# Altium project ECTU.PrjPcb
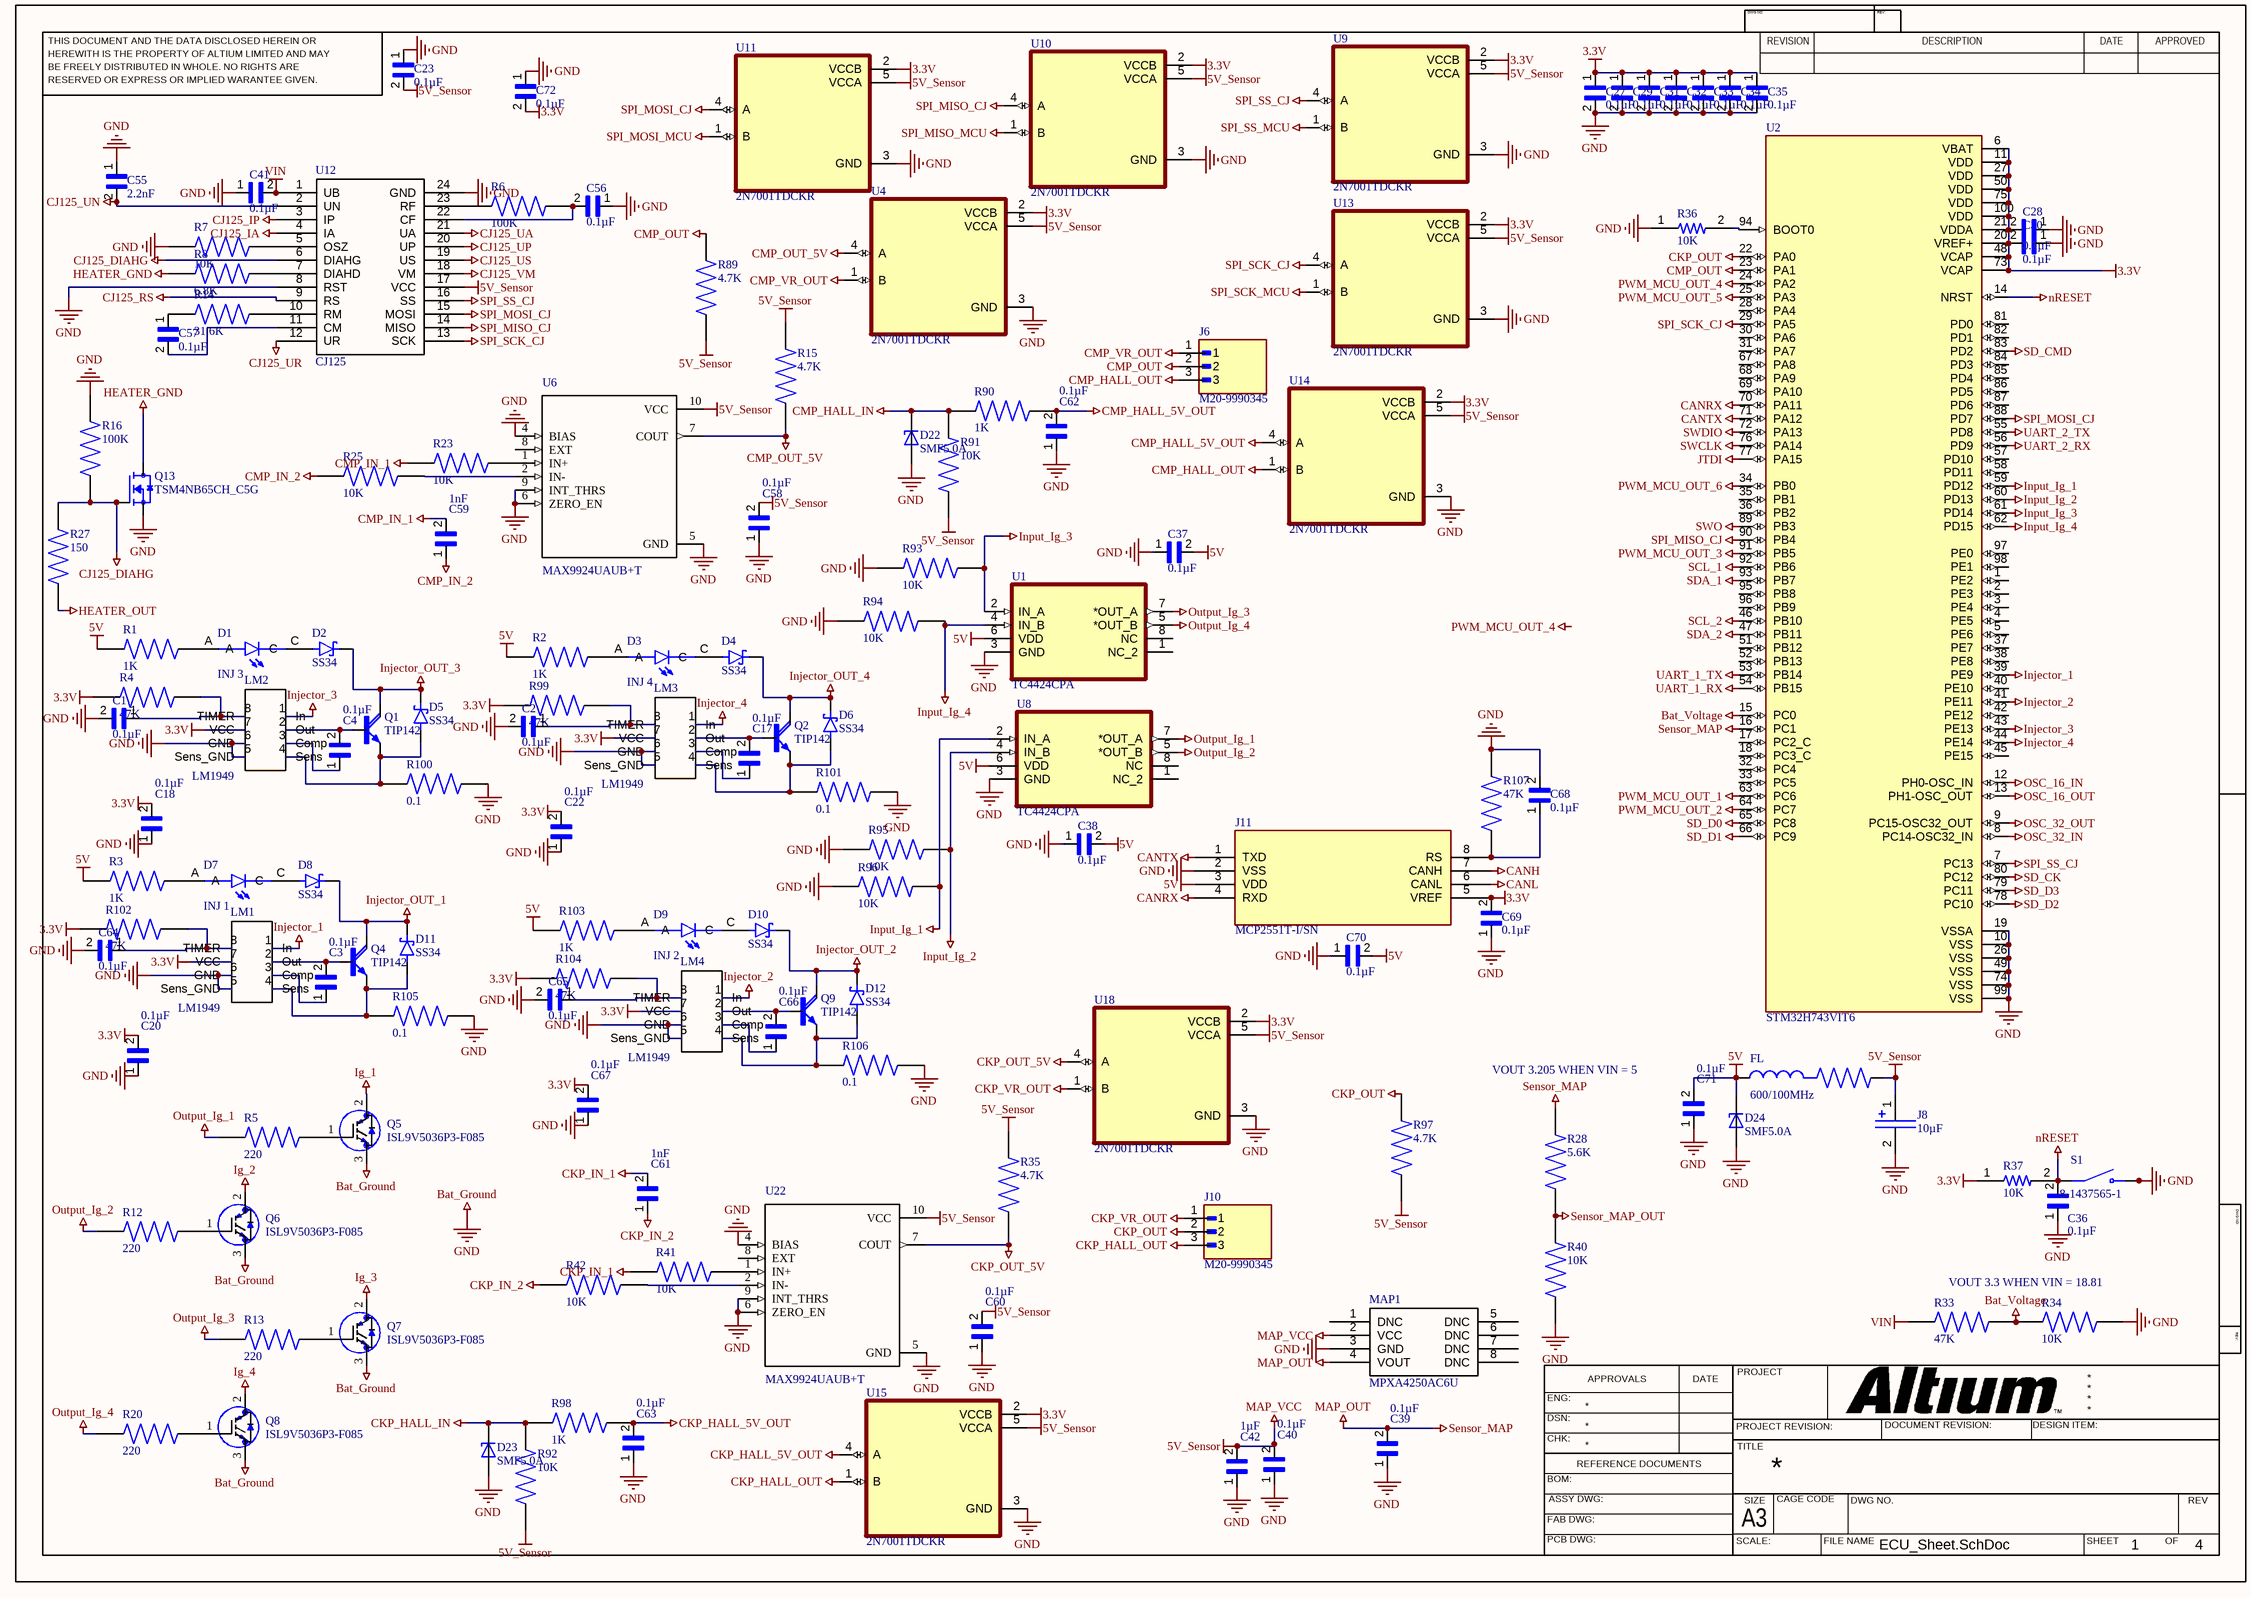
[diagram p0: ECU_Sheet.SchDoc]
4 sheets, 273 parts. Net scope: global (net labels, ports and power ports of the same name join across sheets).
Board file: ECTU_PCB.PcbDoc
Sheets:
  ECU_Sheet.SchDoc
  CCU_Sheet.SchDoc
  Analog_Sensors_Sheet.SchDoc
  Display_IOT_Sheet.SchDoc

## Sheet ECU_Sheet.SchDoc
size 420 x 297 mm; SheetNumber: 1; SheetTotal: 4

### Parts
C1  0.1µF  [CAPC1608X90N]
C2  0.1µF  [CAPC1608X90N]
C3  0.1µF  [CAPC1608X90N]
C4  0.1µF  [CAPC1608X90N]
C17  0.1µF  [CAPC1608X90N]
C18  0.1µF  [CAPC1608X90N]
C20  0.1µF  [CAPC1608X90N]
C22  0.1µF  [CAPC1608X90N]
C23  0.1µF  [CAPC1608X90N]
C27  0.1µF  [CAPC1608X90N]
C28  0.1µF  [CAPC1608X90N]
C29  0.1µF  [CAPC1608X90N]
C30  0.1µF  [CAPC1608X90N]
C31  0.1µF  [CAPC1608X90N]
C32  0.1µF  [CAPC1608X90N]
C33  0.1µF  [CAPC1608X90N]
C34  0.1µF  [CAPC1608X90N]
C35  0.1µF  [CAPC1608X90N]
C36  0.1µF  [CAPC1608X90N]
C37  0.1µF  [CAPC1608X90N]
C38  0.1µF  [CAPC1608X90N]
C39  0.1µF  [CAPC1608X90N]
C40  0.1µF  [CAPC1608X90N]
C41  0.1µF  [CAPC1608X90N]
C42  1µF  [CAPC1608X90N]
C55  2.2nF  [CAPC1608X90N]
C56  0.1µF  [CAPC1608X90N]
C57  0.1µF  [CAPC1608X90N]
C58  0.1µF  [CAPC1608X90N]
C59  1nF  [CAPC1608X90N]
C60  0.1µF  [CAPC1608X90N]
C61  1nF  [CAPC1608X90N]
C62  0.1µF  [CAPC1608X90N]
C63  0.1µF  [CAPC1608X90N]
C64  0.1µF  [CAPC1608X90N]
C65  0.1µF  [CAPC1608X90N]
C66  0.1µF  [CAPC1608X90N]
C67  0.1µF  [CAPC1608X90N]
C68  0.1µF  [CAPC1608X90N]
C69  0.1µF  [CAPC1608X90N]
C70  0.1µF  [CAPC1608X90N]
C71  0.1µF  [CAPC1608X90N]
C72  0.1µF  [CAPC1608X90N]
D1  INJ 3  [LEDC2012X70N]
D2  SS34  [DIO_SS34]
D3  INJ 4  [LEDC2012X70N]
D4  SS34  [DIO_SS34]
D5  SS34  [DIO_SS34]
D6  SS34  [DIO_SS34]
D7  INJ 1  [LEDC2012X70N]
D8  SS34  [DIO_SS34]
D9  INJ 2  [LEDC2012X70N]
D10  SS34  [DIO_SS34]
D11  SS34  [DIO_SS34]
D12  SS34  [DIO_SS34]
D22  SMF5.0A  [SODFL3718X102N]
D23  SMF5.0A  [SODFL3718X102N]
D24  SMF5.0A  [SODFL3718X102N]
FL  600/100MHz  [BEADC1608X95N]
J6  M20-9990345  [HARWIN_M20-9990345]
J8  10µF  [T491A106K010AT]
J10  M20-9990345  [HARWIN_M20-9990345]
J11  MCP2551T-I/SN  [SOIC8-N_MC]
LM1  LM1949  [DIP794W45P254L959H508Q8]
LM2  LM1949  [DIP794W45P254L959H508Q8]
LM3  LM1949  [DIP794W45P254L959H508Q8]
LM4  LM1949  [DIP794W45P254L959H508Q8]
MAP1  MPXA4250AC6U  [SOIC127P1041X990-8N]
Q1  TIP142  [SOT93]
Q2  TIP142  [SOT93]
Q4  TIP142  [SOT93]
Q5  ISL9V5036P3-F085  [*TO254P470X1016X2019-3P]
Q6  ISL9V5036P3-F085  [*TO254P470X1016X2019-3P]
Q7  ISL9V5036P3-F085  [*TO254P470X1016X2019-3P]
Q8  ISL9V5036P3-F085  [*TO254P470X1016X2019-3P]
Q9  TIP142  [SOT93]
Q13  TSM4NB65CH_C5G  [TO228P680X240X837-3]
R1  1K  [RESC3116X65N]
R2  1K  [RESC3116X65N]
R3  1K  [RESC3116X65N]
R4  47K  [RESC3116X65N]
R5  220  [RES_ERJP08J221V]
R6  100K  [RESC3116X65N]
R7  10K  [RESC3116X65N]
R8  6.8K  [RESC3116X65N]
R12  220  [RES_ERJP08J221V]
R13  220  [RES_ERJP08J221V]
R14  31.6K  [RESC3116X65N]
R15  4.7K  [RESC3116X65N]
R16  100K  [RESC3116X65N]
R20  220  [RES_ERJP08J221V]
R23  10K  [RESC3116X65N]
R25  10K  [RESC3116X65N]
R27  150  [RESC3116X65N]
R28  5.6K  [RESC3116X65N]
R33  47K  [RESC3116X65N]
R34  10K  [RESC3116X65N]
R35  4.7K  [RESC3116X65N]
R36  10K  [RESC1608X50N]
R37  10K  [RESC1608X50N]
R40  10K  [RESC3116X65N]
R41  10K  [RESC3116X65N]
R42  10K  [RESC3116X65N]
R89  4.7K  [RESC3116X65N]
R90  1K  [RESC3116X65N]
R91  10K  [RESC3116X65N]
R92  10K  [RESC3116X65N]
R93  10K  [RESC3116X65N]
R94  10K  [RESC3116X65N]
R95  10K  [RESC3116X65N]
R96  10K  [RESC3116X65N]
R97  4.7K  [RESC3116X65N]
R98  1K  [RESC3116X65N]
R99  47K  [RESC3116X65N]
R100  0.1  [RES_ERJ6RSFR10V]
R101  0.1  [RES_ERJ6RSFR10V]
R102  47K  [RESC3116X65N]
R103  1K  [RESC3116X65N]
R104  47K  [RESC3116X65N]
R105  0.1  [RES_ERJ6RSFR10V]
R106  0.1  [RES_ERJ6RSFR10V]
R107  47K  [RESC3116X65N]
S1  8-1437565-1  [SW_8-1437565-1]
U1  TC4424CPA  [DIP254P762X432-8]
U2  STM32H743VIT6  [QFP50P1600X1600X160-100N]
U4  2N7001TDCKR  [SOT65P210X110-5N]
U6  MAX9924UAUB+T  [*SOP50P490X110-10N]
U8  TC4424CPA  [DIP254P762X432-8]
U9  2N7001TDCKR  [SOT65P210X110-5N]
U10  2N7001TDCKR  [SOT65P210X110-5N]
U11  2N7001TDCKR  [SOT65P210X110-5N]
U12  CJ125  [CJ125]
U13  2N7001TDCKR  [SOT65P210X110-5N]
U14  2N7001TDCKR  [SOT65P210X110-5N]
U15  2N7001TDCKR  [SOT65P210X110-5N]
U18  2N7001TDCKR  [SOT65P210X110-5N]
U22  MAX9924UAUB+T  [*SOP50P490X110-10N]

### Nets
3.3V: C18.2 C20.2 C22.2 C27.1 C28.2 C29.1 C30.2 C31.1 C32.1 C33.1 C34.1 C35.1 C67.2 C69.2 C72.2 J11.5(VREF) LM1.7(VCC) LM2.7(VCC) LM3.7(VCC) LM4.7(VCC) R4.1 R37.1 R99.1 R102.1 R104.1 U2.6(VBAT) U2.11(VDD) U2.20(VREF+) U2.21(VDDA) U2.27(VDD) U2.48(VCAP) U2.50(VDD) U2.73(VCAP) U2.75(VDD) U2.100(VDD) U4.2(VCCB) U9.2(VCCB) U10.2(VCCB) U11.2(VCCB) U13.2(VCCB) U14.2(VCCB) U15.2(VCCB) U18.2(VCCB)
5V: C37.2 C38.2 C70.2 C71.2 D24.C FL.1 J11.3(VDD) R1.1 R2.1 R3.1 R103.1 U1.6(VDD) U8.6(VDD)
5V_Sensor: C23.2 C40.2 C42.2 C58.2 C60.2 FL.2 J8.1(P$1) MAP1.2(VCC) R15.2 R35.2 R89.1 R91.1 R92.1 R97.1 U4.5(VCCA) U6.10(VCC) U9.5(VCCA) U10.5(VCCA) U11.5(VCCA) U12.17(VCC) U13.5(VCCA) U14.5(VCCA) U15.5(VCCA) U18.5(VCCA) U22.10(VCC)  [also labelled MAP_VCC]
Bat_Ground: C1.2 C2.2 C18.1 C20.1 C22.1 C23.1 C27.2 C28.1 C29.2 C30.1 C31.2 C32.2 C33.2 C34.2 C35.2 C36.1 C37.1 C38.1 C39.1 C40.1 C41.1 C42.1 C55.1 C56.1 C58.1 C60.1 C62.1 C63.1 C64.2 C65.2 C67.1 C68.2 C69.1 C70.1 C71.1 C72.1 D22.A D23.A D24.A J8.2(P$2) J11.2(VSS) LM1.5(Sens_GND) LM1.6(GND) LM2.5(Sens_GND) LM2.6(GND) LM3.5(Sens_GND) LM3.6(GND) LM4.5(Sens_GND) LM4.6(GND) MAP1.3(GND) Q5.3(E) Q6.3(E) Q7.3(E) Q8.3(E) Q13.3(S) R7.1 R16.2 R34.2 R36.1 R40.1 R93.1 R94.1 R95.1 R96.1 R100.2 R101.2 R105.2 R106.2 R107.2 S1.3(NO) S1.4(NO) U1.3(GND) U2.10(VSS) U2.19(VSSA) U2.26(VSS) U2.49(VSS) U2.74(VSS) U2.99(VSS) U4.3(GND) U6.4(BIAS) U6.5(GND) U6.6(ZERO_EN) U6.9(INT_THRS) U8.3(GND) U9.3(GND) U10.3(GND) U11.3(GND) U12.8(RST) U12.24(GND) U13.3(GND) U14.3(GND) U15.3(GND) U18.3(GND) U22.4(BIAS) U22.5(GND) U22.6(ZERO_EN) U22.9(INT_THRS)  [also labelled GND]
Bat_Voltage: R33.2 R34.1 U2.15(PC0)
CANH: J11.7(CANH)
CANL: J11.6(CANL)
CANRX: J11.4(RXD) U2.70(PA11)
CANTX: J11.1(TXD) U2.71(PA12)
CJ125_DIAHG: Q13.1(G) R16.1 R27.2 U12.6(DIAHG)
CJ125_IA: U12.4(IA)
CJ125_IP: U12.3(IP)
CJ125_RS: U12.9(RS)
CJ125_UA: U12.21(UA)
CJ125_UN: C55.2 U12.2(UN)
CJ125_UP: U12.20(UP)
CJ125_UR: U12.12(UR)
CJ125_US: U12.19(US)
CJ125_VM: U12.18(VM)
CKP_HALL_5V_OUT: C63.2 R98.1 U15.4(A)
CKP_HALL_IN: D23.C R92.2 R98.2
CKP_HALL_OUT: J10.3 U15.1(B)
CKP_IN_1: C61.2 R41.1
CKP_IN_2: C61.1 R42.1
CKP_OUT: J10.2 R97.2 U2.22(PA0)
CKP_OUT_5V: R35.1 U18.4(A) U22.7(COUT)
CKP_VR_OUT: J10.1 U18.1(B)
CMP_HALL_5V_OUT: C62.2 R90.1 U14.4(A)
CMP_HALL_IN: D22.C R90.2 R91.2
CMP_HALL_OUT: J6.3 U14.1(B)
CMP_IN_1: C59.2 R23.1
CMP_IN_2: C59.1 R25.1
CMP_OUT: J6.2 R89.2 U2.23(PA1)
CMP_OUT_5V: R15.1 U4.4(A) U6.7(COUT)
CMP_VR_OUT: J6.1 U4.1(B)
HEATER_GND: Q13.2(D) R8.1
HEATER_OUT: R27.1
Ig_1: Q5.2(C)
Ig_2: Q6.2(C)
Ig_3: Q7.2(C)
Ig_4: Q8.2(C)
Injector_1: LM1.1(In) U2.39(PE9)
Injector_2: LM4.1(In) U2.41(PE11)
Injector_3: LM2.1(In) U2.43(PE13)
Injector_4: LM3.1(In) U2.44(PE14)
Injector_OUT_1: D8.C(K) D11.C(K) Q4.C
Injector_OUT_2: D10.C(K) D12.C(K) Q9.C
Injector_OUT_3: D2.C(K) D5.C(K) Q1.C
Injector_OUT_4: D4.C(K) D6.C(K) Q2.C
Input_Ig_1: R96.2 U2.59(PD12) U8.2(IN_A)
Input_Ig_2: R95.2 U2.60(PD13) U8.4(IN_B)
Input_Ig_3: R93.2 U1.2(IN_A) U2.61(PD14)
Input_Ig_4: R94.2 U1.4(IN_B) U2.62(PD15)
JTDI: U2.77(PA15)
MAP_OUT: C39.2 MAP1.4(VOUT) R28.1 U2.16(PC1)  [also labelled Sensor_MAP]
nRESET: C36.2 R37.2 S1.1(COM) S1.2(COM) U2.14(NRST)
OSC_16_IN: U2.12(PH0-OSC_IN)
OSC_16_OUT: U2.13(PH1-OSC_OUT)
OSC_32_IN: U2.8(PC14-OSC32_IN)
OSC_32_OUT: U2.9(PC15-OSC32_OUT)
Output_Ig_1: R5.1 U8.7(*OUT_A)
Output_Ig_2: R12.1 U8.5(*OUT_B)
Output_Ig_3: R13.1 U1.7(*OUT_A)
Output_Ig_4: R20.1 U1.5(*OUT_B)
PWM_MCU_OUT_1: U2.63(PC6)
PWM_MCU_OUT_2: U2.64(PC7)
PWM_MCU_OUT_3: U2.91(PB5)
PWM_MCU_OUT_4: U2.24(PA2)
PWM_MCU_OUT_5: U2.25(PA3)
PWM_MCU_OUT_6: U2.34(PB0)
SCL_1: U2.92(PB6)
SCL_2: U2.46(PB10)
SD_CK: U2.80(PC12)
SD_CMD: U2.83(PD2)
SD_D0: U2.65(PC8)  [project net DATA_0]
SD_D1: U2.66(PC9)  [project net DATA_1]
SD_D2: U2.78(PC10)  [project net DATA_2]
SD_D3: U2.79(PC11)  [project net DATA_3]
SDA_1: U2.93(PB7)
SDA_2: U2.47(PB11)
Sensor_MAP_OUT: R28.2 R40.2
SPI_MISO_CJ: U2.90(PB4) U10.4(A) U12.14(MISO)
SPI_MISO_MCU: U10.1(B)
SPI_MOSI_CJ: U2.88(PD7) U11.4(A) U12.15(MOSI)
SPI_MOSI_MCU: U11.1(B)
SPI_SCK_CJ: U2.29(PA5) U12.13(SCK) U13.4(A)
SPI_SCK_MCU: U13.1(B)
SPI_SS_CJ: U2.7(PC13) U9.4(A) U12.16(SS)
SPI_SS_MCU: U9.1(B)
SWCLK: U2.76(PA14)
SWDIO: U2.72(PA13)
SWO: U2.89(PB3)
UART_1_RX: U2.54(PB15)
UART_1_TX: U2.53(PB14)
UART_2_RX: U2.56(PD9)
UART_2_TX: U2.55(PD8)
VIN: C41.2 R33.1 U12.1(UB)
NetC1_1: C1.1 LM2.8(TIMER) R4.2
NetC2_1: C2.1 LM3.8(TIMER) R99.2
NetC3_1: C3.1 LM1.3(Comp)
NetC3_2: C3.2 LM1.2(Out) Q4.B
NetC4_1: C4.1 LM2.3(Comp)
NetC4_2: C4.2 LM2.2(Out) Q1.B
NetC17_1: C17.1 LM3.3(Comp)
NetC17_2: C17.2 LM3.2(Out) Q2.B
NetC56_2: C56.2 R6.2 U12.22(CF)
NetC57_1: C57.1 R14.1
NetC57_2: C57.2 U12.11(CM)
NetC64_1: C64.1 LM1.8(TIMER) R102.2
NetC65_1: C65.1 LM4.8(TIMER) R104.2
NetC66_1: C66.1 LM4.3(Comp)
NetC66_2: C66.2 LM4.2(Out) Q9.B
NetC68_1: C68.1 J11.8(RS) R107.1
NetD1_A: D1.A R1.2
NetD1_C: D1.C D2.A
NetD3_A: D3.A R2.2
NetD3_C: D3.C D4.A
NetD5_A: D5.A LM2.4(Sens) Q1.E R100.1
NetD6_A: D6.A LM3.4(Sens) Q2.E R101.1
NetD7_A: D7.A R3.2
NetD7_C: D7.C D8.A
NetD9_A: D9.A R103.2
NetD9_C: D9.C D10.A
NetD11_A: D11.A LM1.4(Sens) Q4.E R105.1
NetD12_A: D12.A LM4.4(Sens) Q9.E R106.1
NetQ5_1: Q5.1(G) R5.2
NetQ6_1: Q6.1(G) R12.2
NetQ7_1: Q7.1(G) R13.2
NetQ8_1: Q8.1(G) R20.2
NetR6_1: R6.1 U12.23(RF)
NetR7_2: R7.2 U12.5(OSZ)
NetR8_2: R8.2 U12.7(DIAHD)
NetR14_2: R14.2 U12.10(RM)
NetR23_2: R23.2 U6.1(IN+)
NetR25_2: R25.2 U6.2(IN-)
NetR36_2: R36.2 U2.94(BOOT0)
NetR41_2: R41.2 U22.1(IN+)
NetR42_2: R42.2 U22.2(IN-)

Not connected (* = marked no-connect by the designer): MAP1 1(DNC) 5(DNC) 6(DNC) 7(DNC) 8(DNC); U1 1(NC_2) 8(NC); U2 1(PE2) 2(PE3) 3(PE4) 4(PE5) 5(PE6) 17(PC2_C) 18(PC3_C) 28(PA4) 30(PA6) 31(PA7) 32(PC4) 33(PC5) 35(PB1) 36(PB2) 37(PE7) 38(PE8) 40(PE10) 42(PE12) 45(PE15) 51(PB12) 52(PB13) 57(PD10) 58(PD11) 67(PA8) 68(PA9) 69(PA10) 81(PD0) 82(PD1) 84(PD3) 85(PD4) 86(PD5) 87(PD6) 95(PB8) 96(PB9) 97(PE0) 98(PE1); U6 8(EXT); U8 1(NC_2) 8(NC); U22 8(EXT)

### Notes on the sheet
- VOUT 3.205 WHEN VIN = 5
- VOUT 3.3 WHEN VIN = 18.81
- Labels drawn without touching a wire or pin: PWM_MCU_OUT_4
- THIS DOCUMENT AND THE DATA DISCLOSED HEREIN OR
- HEREWITH IS THE PROPERTY OF ALTIUM LIMITED AND MAY
- DWG NO:
- REVISION
- REV:
- DESCRIPTION
- DATE
- APPROVED
- BE FREELY DISTRIBUTED IN WHOLE. NO RIGHTS ARE
- RESERVED OR EXPRESS OR IMPLIED WARANTEE GIVEN.
- ENG:
- APPROVALS
- PROJECT
- DSN:
- CHK:
- REFERENCE DOCUMENTS
- PROJECT REVISION:
- TITLE
- DOCUMENT REVISION:
- DESIGN ITEM:
- BOM:
- FAB DWG:
- PCB DWG:
- ASSY DWG:
- SCALE:
- A3
- SIZE
- CAGE CODE
- FILE NAME
- DWG NO.
- SHEET
- OF
- REV

### Library data of the parts
C1-C4 C17 C18 C20 C22 C23 C27-C42 C55-C72 = 06035C104MAZ2A: Multilayer Ceramic Capacitors MLCC - SMD/SMT; Package: None; Price: None; Value: *; MP: 06035C104MAZ2A; Availability: Unavailable
D1 D3 D7 D9 = 597-3305-607F: LED Uni-Color Green 4-Pin Chip 0805 T/R; Availability: Unavailable; Value: *; Price: None; MP: 597-3305-607F; Package: None
D2 D4-D6 D8 D10-D12 = SS34: 3A, 40V, Schottky Rectifier; MF: Taiwan Semiconductor; SnapEDA_Link: https://www.snapeda.com/parts/SS34/Taiwan+Semiconductor/view-part/?ref=snap; Package: DO-214AB-2 Taiwan Semiconductor; Value: *; MP: SS34; Check_prices: https://www.snapeda.com/parts/SS34/Taiwan+Semiconductor/view-part/?ref=eda
D22-D24 = SMF5.0A: 200W, 6.7V, 5%, Unidirectional, TVS; MF: Taiwan Semiconductor; SnapEDA_Link: https://www.snapeda.com/parts/SMF5.0A/taiwan/view-part/?ref=snap; Package: SOD-123W-2 Taiwan Semiconductor; Value: *; MP: SMF5.0A; Check_prices: https://www.snapeda.com/parts/SMF5.0A/taiwan/view-part/?ref=eda
FL = BLM18DN601SZ1D: 600 Ohms @ 100MHz 1 Ferrite Bead 0603 _1608 Metric_ 700mA; MF: Murata; Package: 1608 Murata; Availability: Unavailable; Value: *; MP: BLM18DN601SZ1D; SnapEDA_Link: https://www.snapeda.com/parts/BLM18DN601SZ1D/Murata/view-part/4302620/?ref=snap; Price: None
J6 J10 = M20-9990345: 2.54mm (0.1) Pitch SIL Vertical Throughboard Pin Header, 6.1mm mating pin height, gold (hi-temp mould), 3 contacts; MF: Harwin; SnapEDA_Link: https://www.snapeda.com/parts/M20-9990345/Harwin+Inc./view-part/?ref=snap; Package: None; Value: *; MP: M20-9990345; Check_prices: https://www.snapeda.com/parts/M20-9990345/Harwin+Inc./view-part/?ref=eda
J8 = T491A106K010AT: Condensador electrolÃ­tico de tantalio sÃ³lido MnO2 de 10 ÂµF, 10 V CC +/-10 %, serie T491 ¦ KEMET T491A106K010AT; SnapEDA_Link: https://www.snapeda.com/parts/T491A106K010AT/KEMET/view-part/?ref=snap; Package: SMD-2 KEMET; Value: *; MF: KEMET; MP: T491A106K010AT; Check_prices: https://www.snapeda.com/parts/T491A106K010AT/KEMET/view-part/?ref=eda
J11 = MCP2551T-I/SN: Microchip MCP2551T-I/SN, CAN Transceiver 1Mbit/s 1-channel ISO 11898, 8-Pin SOIC | Microchip Technology Inc. MCP2551T-I/SN; SnapEDA_Link: https://www.snapeda.com/parts/MCP2551T-I/SN/Microchip/view-part/?ref=snap; Package: SO-8 Microchip; Value: *; MF: Microchip; MP: MCP2551T-I/SN; Check_prices: https://www.snapeda.com/parts/MCP2551T-I/SN/Microchip/view-part/?ref=eda
LM1-LM4 = Component_1
Q1 Q2 Q4 Q9 = TIP142: Bipolar (BJT) Transistor NPN - Darlington 100 V 10 A - 125 W Through Hole TO-247-3; MF: ON Semiconductor; SnapEDA_Link: https://www.snapeda.com/parts/TIP142/Onsemi/view-part/?ref=snap; Package: SOT-93-3 ON Semiconductor; Value: *; MP: TIP142; Check_prices: https://www.snapeda.com/parts/TIP142/Onsemi/view-part/?ref=eda
Q13 = TSM4NB65CH_C5G: 650V, 4A, Single N-Channel Power MOSFET; MF: Taiwan Semiconductor; MP: TSM4NB65CH C5G; SnapEDA_Link: https://www.snapeda.com/parts/TSM4NB65CH%20C5G/Taiwan+Semiconductor/view-part/?ref=snap; Package: TO-251 Taiwan Semiconductor; Value: *; Check_prices: https://www.snapeda.com/parts/TSM4NB65CH%20C5G/Taiwan+Semiconductor/view-part/?ref=eda
R1-R3 R103 = RC1206JR-071KL: RES, THICK FILM, 1K, 5%, 0.25W, 1206; Resistance:1kohm; Resistance Tolerance:Â± 5%; Power Rating:250mW; Resistor Case Style:1206 ^3216 Metric]; Resistor Technology:Thick Film; Resistor Type:General Purpose; Product Range:RC Series; MF: Yageo Corporation; MP: RC1206JR071KL; SnapEDA_Link: https://www.snapeda.com/parts/RC1206JR071KL/Yageo/view-part/?ref=snap; Package: 1206-2 YAGEO; Value: *; Check_prices: https://www.snapeda.com/parts/RC1206JR071KL/Yageo/view-part/?ref=eda
R4 R6-R8 R14-R16 R23 R25 R27 R28 R33-R35 R40-R42 R89-R99 R102 R104 R107 = AA1206JR-07470RL: Package: None; Price: None; Value: *; MP: AA1206JR-07470RL; Availability: Unavailable
R5 R12 R13 R20 = ERJP08J221V: Value: *; Price: None; Availability: Unavailable; Package: None; MP: ERJP08J221V
R36 R37 = RP73PF1J10KBTDF: Thin Film Resistors - SMD 10K OHM .1% 25PPM; Voltage_Rating: 75 V; Power_Rating: .166 W; MF: TE Connectivity; Mouser-Purchase-URL: https://snapeda.com/shop?store=Mouser&id=550687; Value: *; SnapEDA_Link: https://www.snapeda.com/parts/RP73PF1J10KBTDF/TE%20Connectivity%20Passive%20Product/view-part/550687/?ref=snap; MP: RP73PF1J10KBTDF; Tolerance: .1%; Digi-Key_Part_Number: A110204CT-ND; Resistance: 10K; Package: 0603
R100 R101 R105 R106 = ERJ6RSFR10V: Availability: Unavailable; MP: ERJ6RSFR10V; Price: None; Package: None; Value: *
U1 U8 = TC4424CPA: Dual MOSFET Power Driver 3A 4.5 to 18V Non-Inverting 8-Pin PDIP | Microchip Technology Inc. TC4424CPA; SnapEDA_Link: https://www.snapeda.com/parts/TC4424CPA/Microchip/view-part/?ref=snap; Package: DIP-8 Microchip; Value: *; MF: Microchip; MP: TC4424CPA; Check_prices: https://www.snapeda.com/parts/TC4424CPA/Microchip/view-part/?ref=eda
U2 = STM32H743VIT6: ARMÂ® CortexÂ®-M7 STM32H7 Microcontroller IC 32-Bit Single-Core 480MHz 2MB (2M x 8) FLASH 100-LQFP (14x14); MF: STMicroelectronics; SnapEDA_Link: https://www.snapeda.com/parts/STM32H743VIT6/STMicroelectronics/view-part/?ref=snap; Package: LQFP-100 STMicroelectronics; Value: *; MP: STM32H743VIT6; Check_prices: https://www.snapeda.com/parts/STM32H743VIT6/STMicroelectronics/view-part/?ref=eda
U4 U9-U11 U13-U15 U18 = 2N7001TDCKR: 1-bit dual-supply buffered voltage signal converter; MF: Texas Instruments; SnapEDA_Link: https://www.snapeda.com/parts/2N7001TDCKR/Texas+Instruments/view-part/?ref=snap; Package: SC70-5 Texas Instruments; Value: *; MP: 2N7001TDCKR; Check_prices: https://www.snapeda.com/parts/2N7001TDCKR/Texas+Instruments/view-part/?ref=eda
Q5-Q8 = ISL9V5036P3-F085: SnapEDA_Link: https://www.snapeda.com/parts/ISL9V5036P3-F085/Onsemi/view-part/?ref=snap; Check_prices: https://www.snapeda.com/parts/ISL9V5036P3-F085/Onsemi/view-part/?ref=eda; Value: *
S1 = 8-1437565-1: Package: None; MP: 8-1437565-1; Price: None; Availability: Unavailable; Value: *
U6 U22 = MAX9924UAUB+T: SnapEDA_Link: https://www.snapeda.com/parts/MAX9924UAUB+T/Maxim+Integrated/view-part/?ref=snap; Check_prices: https://www.snapeda.com/parts/MAX9924UAUB+T/Maxim+Integrated/view-part/?ref=eda; Value: *

## Sheet CCU_Sheet.SchDoc
size 420 x 297 mm; SheetNumber: 2; SheetTotal: 4
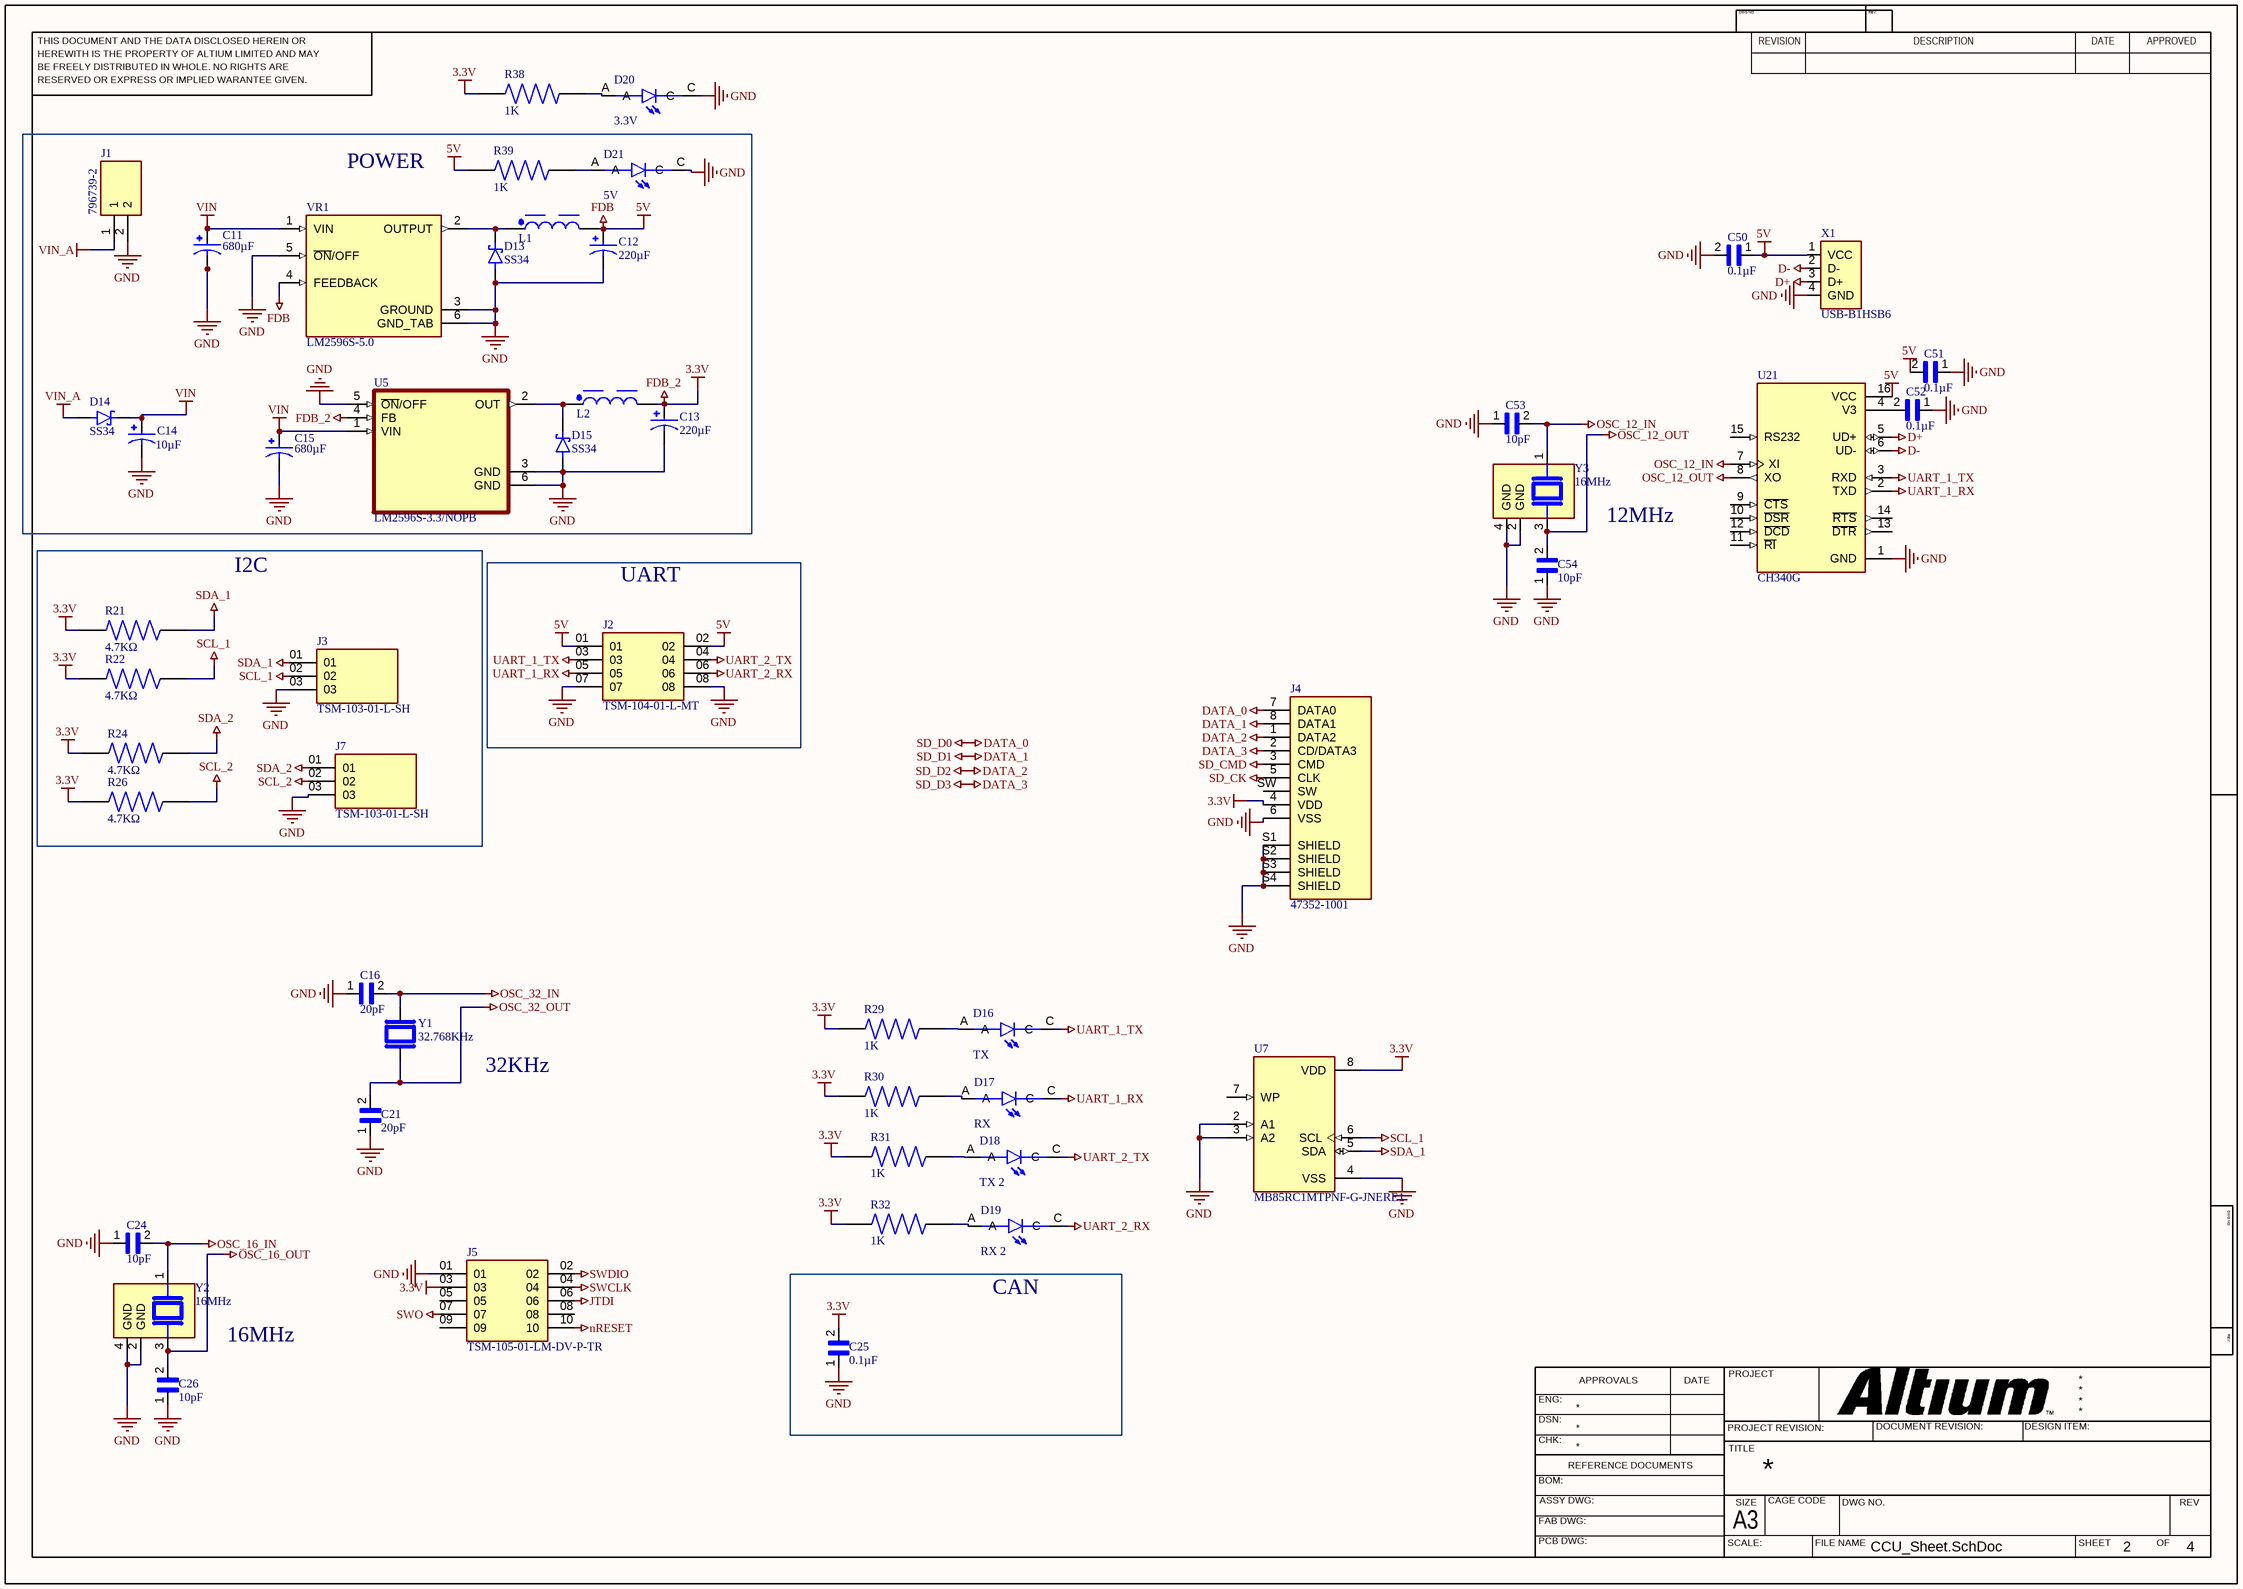
[diagram p1: CCU_Sheet.SchDoc]

### Parts
C11  680µF  [CAP_EEEFN1E681UV]
C12  220µF  [CAP_EEEFP1V221AV]
C13  220µF  [CAP_EEEFP1V221AV]
C14  10µF  [CAPPRD500W50D500H1100]
C15  680µF  [CAP_EEEFN1E681UV]
C16  20pF  [CAPC1005X61N]
C21  20pF  [CAPC1005X61N]
C24  10pF  [CAPC1005X61N]
C25  0.1µF  [CAPC1608X90N]
C26  10pF  [CAPC1005X61N]
C50  0.1µF  [CAPC1608X90N]
C51  0.1µF  [CAPC1608X90N]
C52  0.1µF  [CAPC1608X90N]
C53  10pF  [CAPC1005X61N]
C54  10pF  [CAPC1005X61N]
D13  SS34  [DIO_SS34]
D14  SS34  [DIO_SS34]
D15  SS34  [DIO_SS34]
D16  TX  [LEDC2012X70N]
D17  RX  [LEDC2012X70N]
D18  TX 2  [LEDC2012X70N]
D19  RX 2  [LEDC2012X70N]
D20  3.3V  [LEDC2012X70N]
D21  5V  [LEDC2012X70N]
J1  796739-2  [TE_796739-2]
J2  TSM-104-01-L-MT  [SAMTEC_TSM-104-01-L-MT]
J3  TSM-103-01-L-SH  [SAMTEC_TSM-103-01-L-SH]
J4  47352-1001  [MOLEX_47352-1001]
J5  TSM-105-01-LM-DV-P-TR  [SAMTEC_TSM-105-01-LM-DV-P-TR]
J7  TSM-103-01-L-SH  [SAMTEC_TSM-103-01-L-SH]
L1  33uH, 4.2A  [WE-PD_1210]  (value not drawn)
L2  33uH, 4.2A  [WE-PD_1210]  (value not drawn)
R21  4.7KΩ  [RES_ERJS06J472V]
R22  4.7KΩ  [RES_ERJS06J472V]
R24  4.7KΩ  [RES_ERJS06J472V]
R26  4.7KΩ  [RES_ERJS06J472V]
R29  1K  [RESC3116X65N]
R30  1K  [RESC3116X65N]
R31  1K  [RESC3116X65N]
R32  1K  [RESC3116X65N]
R38  1K  [RESC3116X65N]
R39  1K  [RESC3116X65N]
U5  LM2596S-3.3/NOPB  [VREG_LM2596S-3.3/NOPB]
U7  MB85RC1MTPNF-G-JNERE1  [SOIC127P600X175-8N]
U21  CH340G  [SOIC127P600X180-16N]
VR1  LM2596S-5.0  [TO170P1524X483-6N]
X1  USB-B1HSB6  [OST_USB-B1HSB6]
Y1  32.768KHz  [XTAL_ABS06-32.768KHZ-9-1-T]
Y2  16MHz  [XTAL_7M25090002]
Y3  16MHz  [XTAL_7M25090002]

### Blocks framed on the sheet
POWER: C11-C15 D13-D15 D21 J1 L1 L2 R39 U5 VR1
I2C: J3 J7 R21 R22 R24 R26
UART: J2
CAN: C25

### Nets
3.3V: C13.1 C25.2 J4.4(VDD) J5.03 L2.2 R21.2 R22.1 R24.2 R26.1 R29.1 R30.1 R31.1 R32.1 R38.1 U5.4(FB) U7.8(VDD)  [also labelled FDB_2]
5V: C12.1 C50.1 C51.2 J2.01 J2.02 L1.2 R39.1 U21.16(VCC) VR1.4(FEEDBACK) X1.1(VCC)  [also labelled FDB]
D+: U21.5(UD+) X1.3(D+)
D-: U21.6(UD-) X1.2(D-)
DATA_0: J4.7(DATA0)  [also labelled SD_D0]
DATA_1: J4.8(DATA1)  [also labelled SD_D1]
DATA_2: J4.1(DATA2)  [also labelled SD_D2]
DATA_3: J4.2(CD/DATA3)  [also labelled SD_D3]
GND: C11.2 C12.2 C13.2 C14.N C15.2 C16.1 C21.1 C24.1 C25.1 C26.1 C50.2 C51.1 C52.1 C53.1 C54.1 D13.A D15.A D20.C D21.C J1.2 J2.07 J2.08 J3.03 J4.6(VSS) J4.S1(SHIELD) J4.S2(SHIELD) J4.S3(SHIELD) J4.S4(SHIELD) J5.01 J7.03 U5.3(GND) U5.5(~{ON}/OFF) U5.6(GND) U7.2(A1) U7.3(A2) U7.4(VSS) U21.1(GND) VR1.3(GROUND) VR1.5(~{ON}/OFF) VR1.6(GND_TAB) X1.4(GND) Y2.2(GND) Y2.4(GND) Y3.2(GND) Y3.4(GND)  [project net Bat_Ground]
JTDI: J5.06
nRESET: J5.10
OSC_12_IN: C53.2 U21.7(XI) Y3.1
OSC_12_OUT: C54.2 U21.8(XO) Y3.3
OSC_16_IN: C24.2 Y2.1
OSC_16_OUT: C26.2 Y2.3
OSC_32_IN: C16.2 Y1.2
OSC_32_OUT: C21.2 Y1.1
SCL_1: J3.02 R22.2 U7.6(SCL)
SCL_2: J7.02 R26.2
SD_CK: J4.5(CLK)
SD_CMD: J4.3(CMD)
SDA_1: J3.01 R21.1 U7.5(SDA)
SDA_2: J7.01 R24.1
SWCLK: J5.04
SWDIO: J5.02
SWO: J5.07
UART_1_RX: D17.C J2.05 U21.2(TXD)
UART_1_TX: D16.C J2.03 U21.3(RXD)
UART_2_RX: D19.C J2.06
UART_2_TX: D18.C J2.04
VIN: C11.1 C14.P C15.1 D14.C(K) U5.1(VIN) VR1.1(VIN)
VIN_A: D14.A J1.1
NetC52_2: C52.2 U21.4(V3)
NetD13_C: D13.C(K) L1.1 VR1.2(OUTPUT)
NetD15_C: D15.C(K) L2.1 U5.2(OUT)
NetD16_A: D16.A R29.2
NetD17_A: D17.A R30.2
NetD18_A: D18.A R31.2
NetD19_A: D19.A R32.2
NetD20_A: D20.A R38.2
NetD21_A: D21.A R39.2

Not connected (* = marked no-connect by the designer): J4 SW; J5 05 08 09; U7 7(WP); U21 9(~{CTS}) 10(~{DSR}) 11(~{RI}) 12(~{DCD}) 13(~{DTR}) 14(~{RTS}) 15(RS232)

### Notes on the sheet
- 12MHz
- 32KHz
- 16MHz
- THIS DOCUMENT AND THE DATA DISCLOSED HEREIN OR
- HEREWITH IS THE PROPERTY OF ALTIUM LIMITED AND MAY
- DWG NO:
- REVISION
- REV:
- DESCRIPTION
- DATE
- APPROVED
- BE FREELY DISTRIBUTED IN WHOLE. NO RIGHTS ARE
- RESERVED OR EXPRESS OR IMPLIED WARANTEE GIVEN.
- ENG:
- APPROVALS
- PROJECT
- DSN:
- CHK:
- REFERENCE DOCUMENTS
- PROJECT REVISION:
- TITLE
- DOCUMENT REVISION:
- DESIGN ITEM:
- BOM:
- FAB DWG:
- PCB DWG:
- ASSY DWG:
- SCALE:
- A3
- SIZE
- CAGE CODE
- FILE NAME
- DWG NO.
- SHEET
- OF
- REV

### Library data of the parts
C11 C15 = EEEFN1E681UV: CAP ALUM 680UF 20% 25V SMD; MF: Panasonic Electronic Components; MP: EEE-FN1E681UV; Value: *; Purchase-URL: https://pricing.snapeda.com/search/part/EEE-FN1E681UV/?ref=eda; Price: None; Check_prices: https://www.snapeda.com/parts/EEE-FN1E681UV/Panasonic/view-part/6178425/?ref=eda; Package: RADIAL-2 Panasonic; Availability: In Stock; SnapEDA_Link: https://www.snapeda.com/parts/EEE-FN1E681UV/Panasonic/view-part/6178425/?ref=snap
C12 C13 = EEEFP1V221AV: CAP ALUM 220UF 20% 35V SMD; MF: Panasonic Electronic Components; MP: EEE-FP1V221AV; SnapEDA_Link: https://www.snapeda.com/parts/EEE-FP1V221AV/Panasonic/view-part/4900934/?ref=snap; Price: None; Availability: Not in stock; Value: *; Check_prices: https://www.snapeda.com/parts/EEE-FP1V221AV/Panasonic/view-part/4900934/?ref=eda; Package: RADIAL-2 Panasonic
C14 = ECEA1EN100UB: 10ÂµF 25V Aluminum Electrolytic Capacitors Radial, Can 2000 Hrs @ 85Â°C; MF: Panasonic; SnapEDA_Link: https://www.snapeda.com/parts/ECEA1EN100UB/Panasonic/view-part/?ref=snap; Price: None; Check_prices: https://www.snapeda.com/parts/ECEA1EN100UB/Panasonic/view-part/?ref=eda; Purchase-URL: https://pricing.snapeda.com/search/part/ECEA1EN100UB/?ref=eda; Package: RADIAL-2 Panasonic; MP: ECEA1EN100UB; Value: *; Availability: In Stock
C16 C21 C24 C26 C53 C54 = VJ0402D200FXAAJ: Package: None; Price: None; Value: *; MP: VJ0402D200FXAAJ; Availability: Unavailable
C25 C50-C52 = 06035C104MAZ2A: as C1 on sheet ECU_Sheet; Package: None; Price: None; Value: *; MP: 06035C104MAZ2A; Availability: Unavailable
D13-D15 = SS34: as D2 on sheet ECU_Sheet; SnapEDA_Link: https://www.snapeda.com/parts/SS34/Taiwan+Semiconductor/view-part/?ref=snap; Package: DO-214AB-2 Taiwan Semiconductor; Value: *; MP: SS34; Check_prices: https://www.snapeda.com/parts/SS34/Taiwan+Semiconductor/view-part/?ref=eda
D16-D21 = 597-3305-607F: LED Uni-Color Green 4-Pin Chip 0805 T/R; Availability: Unavailable; Value: *; Price: None; MP: 597-3305-607F; Package: None
J1 = 796739-2: Conn Terminal Block F 2 POS 9.53mm Solder RA Thru-Hole 32A/Contact; MF: TE Connectivity; Number_of_Positions: 2; Centerline_Pitch: 9.53 mm[.375 in]; Package: None; Value: *; Price: None; EU_RoHS_Compliance: Compliant with Exemptions; MP: 796739-2; TE_purchase_URL: https://www.te.com/usa-en/product-796739-2.html?te_bu=Cor&te_type=disp&te_campaign=seda_glo_cor-seda-global-disp-prtnr-fy19-seda-model-bom-cta_sma-317_1&elqCampaignId=32493; Availability: Unavailable; SnapEDA_Link: https://www.snapeda.com/parts/796739-2/TE%20Connectivity%20AMP%20Connectors/view-part/279084/?ref=snap
J2 = TSM-104-01-L-MT: TSM Series .100 Surface Mount Terminal Strip; MF: Samtec; SnapEDA_Link: https://www.snapeda.com/parts/TSM-104-01-L-MT/Samtec/view-part/?ref=snap; Package: None; Value: *; MP: TSM-104-01-L-MT; Check_prices: https://www.snapeda.com/parts/TSM-104-01-L-MT/Samtec/view-part/?ref=eda
J3 J7 = TSM-103-01-L-SH: MF: Samtec Inc.; Package: None; MP: TSM-103-01-L-SH; Value: *; Price: None; Availability: Unavailable
J4 = 47352-1001: 8 (6 + 2) Position Card Connector Secure Digital - microSDâ„¢ Surface Mount, Right Angle Gold; MP: 473521001; MF: Molex; Price: None; Availability: In Stock; Package: None; Value: *; Purchase-URL: https://pricing.snapeda.com/search/part/473521001/?ref=eda
J5 = TSM-105-01-LM-DV-P-TR: TSM - Samtec 2.54mm Dual Row Vertical Surface Mount Header 5.84mm Post Height (01) - Fast Stock; Check_prices: https://www.snapeda.com/parts/TSM-105-01-LM-DV-P-TR/Samtec/view-part/3284031/?ref=eda; MF: Samtec; Package: None; Purchase-URL: https://pricing.snapeda.com/search/part/TSM-105-01-LM-DV-P-TR/?ref=eda; Availability: In Stock; Value: *; MP: TSM-105-01-LM-DV-P-TR; SnapEDA_Link: https://www.snapeda.com/parts/TSM-105-01-LM-DV-P-TR/Samtec/view-part/3284031/?ref=snap; Price: None
L1 L2 = 7447709330: WE-PD SMT Power Inductor, size 1210, 33uH, 4.2A, 45mOhm; Manufacturer: Wurth Elektronik; Case/Size Code: 1210; DC Resistance: 37mOhm; Saturation Current: 5.5A; Self Resonant Frequency: 8.5MHz; Type: Standard; Manufacturer Part Number: 7447709330; Category: Power Inductors; Match Code: WE-PD; ComponentLink1Description: Website Link; ComponentLink1URL: https://www.we-online.com/redexpert/article/7447709330?ad; ComponentLink2Description: Datasheet Link; ComponentLink2URL: https://www.we-online.com/redexpert/spec/7447709330?ad; Mount: Surface Mount; Operating Temperature Max: 125°C; Operating Temperature Min: -40°C; Packaging: Tape and Reel; Length: 12mm; Width: 12mm; Height: 10mm; DC Resistance Max: 45mOhm; Inductance: 33uH; Rated Current: 4.2A
R21 R22 R24 R26 = ERJS06J472V: Price: None; Availability: Unavailable; MP: ERJS06J472V; Package: None; Value: *
R29-R32 R38 R39 = RC1206JR-071KL: as R1 on sheet ECU_Sheet; SnapEDA_Link: https://www.snapeda.com/parts/RC1206JR071KL/Yageo/view-part/?ref=snap; Package: 1206-2 YAGEO; Value: *; Check_prices: https://www.snapeda.com/parts/RC1206JR071KL/Yageo/view-part/?ref=eda
U7 = MB85RC1MTPNF-G-JNERE1: FRAM _Ferroelectric RAM_ Memory IC 1Mb _128K x 8_ IÂ²C 3.4MHz 130ns 8-SOP; MF: Fujitsu Electronics; MP: MB85RC1MTPNF-G-JNERE1; Price: None; SnapEDA_Link: https://www.snapeda.com/parts/MB85RC1MTPNF-G-JNERE1/Fujitsu%20Electronics%20America%2C%20Inc./view-part/2842124/?ref=snap; Availability: Unavailable; Value: *; Package: SO-8 Fujitsu
U21 = CH340G: USB Interface Integrated Circuit; MF: WCH; Value: *; SnapEDA_Link: https://www.snapeda.com/parts/Ch340G/WCH/view-part/?ref=snap; MP: Ch340G; Check_prices: https://www.snapeda.com/parts/Ch340G/WCH/view-part/?ref=eda; Availability: Not in stock; Price: None; Package: None
VR1 = LM2596S-5.0: SIMPLE SWITCHER&reg; 4.5V to 40V, 3A Low Component Count Step-Down Regulator; MP: LM2596S-5.0/NOPB; MF: Texas Instruments; Price: None; Availability: In Stock; Package: TO-263-5 Texas Instruments; SnapEDA_Link: https://www.snapeda.com/parts/LM2596S-5.0/NOPB/Texas+Instruments/view-part/?ref=snap; Check_prices: https://www.snapeda.com/parts/LM2596S-5.0/NOPB/Texas+Instruments/view-part/?ref=eda; Value: *; Purchase-URL: https://pricing.snapeda.com/search/part/LM2596S-5.0/NOPB/?ref=eda
X1 = USB-B1HSB6: USB-B (USB TYPE-B) - Receptacle Connector 4 Position Through Hole, Right Angle; MF: On Shore; Check_prices: https://www.snapeda.com/parts/USB-B1HSB6/On+Shore+Technology+Inc./view-part/?ref=eda; Value: *; Purchase-URL: https://pricing.snapeda.com/search/part/USB-B1HSB6/?ref=eda; Price: None; MP: USB-B1HSB6; SnapEDA_Link: https://www.snapeda.com/parts/USB-B1HSB6/On+Shore+Technology+Inc./view-part/?ref=snap; Availability: In Stock; Package: None
Y1 = ABS06-32.768KHZ-9-1-T: 32.768 kHz Â±10ppm Crystal 9pF 90 kOhms 2-SMD, No Lead; MF: Abracon; Availability: In Stock; Value: *; Purchase-URL: https://pricing.snapeda.com/search/part/ABS06-32.768KHZ-9-1-T/?ref=eda; Price: None; Check_prices: https://www.snapeda.com/parts/ABS06-32.768KHZ-9-1-T/Abracon+LLC/view-part/?ref=eda; MP: ABS06-32.768KHZ-9-1-T; Package: SMD-2 Abracon LLC; SnapEDA_Link: https://www.snapeda.com/parts/ABS06-32.768KHZ-9-1-T/Abracon+LLC/view-part/?ref=snap
Y2 Y3 = 7M25090002: 25 MHz Â±10ppm Crystal 18pF 4-SMD, No Lead; MF: TXC; Availability: In Stock; Check_prices: https://www.snapeda.com/parts/7M25090002/TXC/view-part/?ref=eda; Price: None; SnapEDA_Link: https://www.snapeda.com/parts/7M25090002/TXC/view-part/?ref=snap; MP: 7M25090002; Value: *; Purchase-URL: https://pricing.snapeda.com/search/part/7M25090002/?ref=eda; Package: SMD-4 TXC
U5 = LM2596S-3.3/NOPB: MP: LM2596S-3.3/NOPB; Availability: Unavailable; Package: None; Value: *; Price: None

## Sheet Analog_Sensors_Sheet.SchDoc
size A2; SheetNumber: 3; SheetTotal: 4
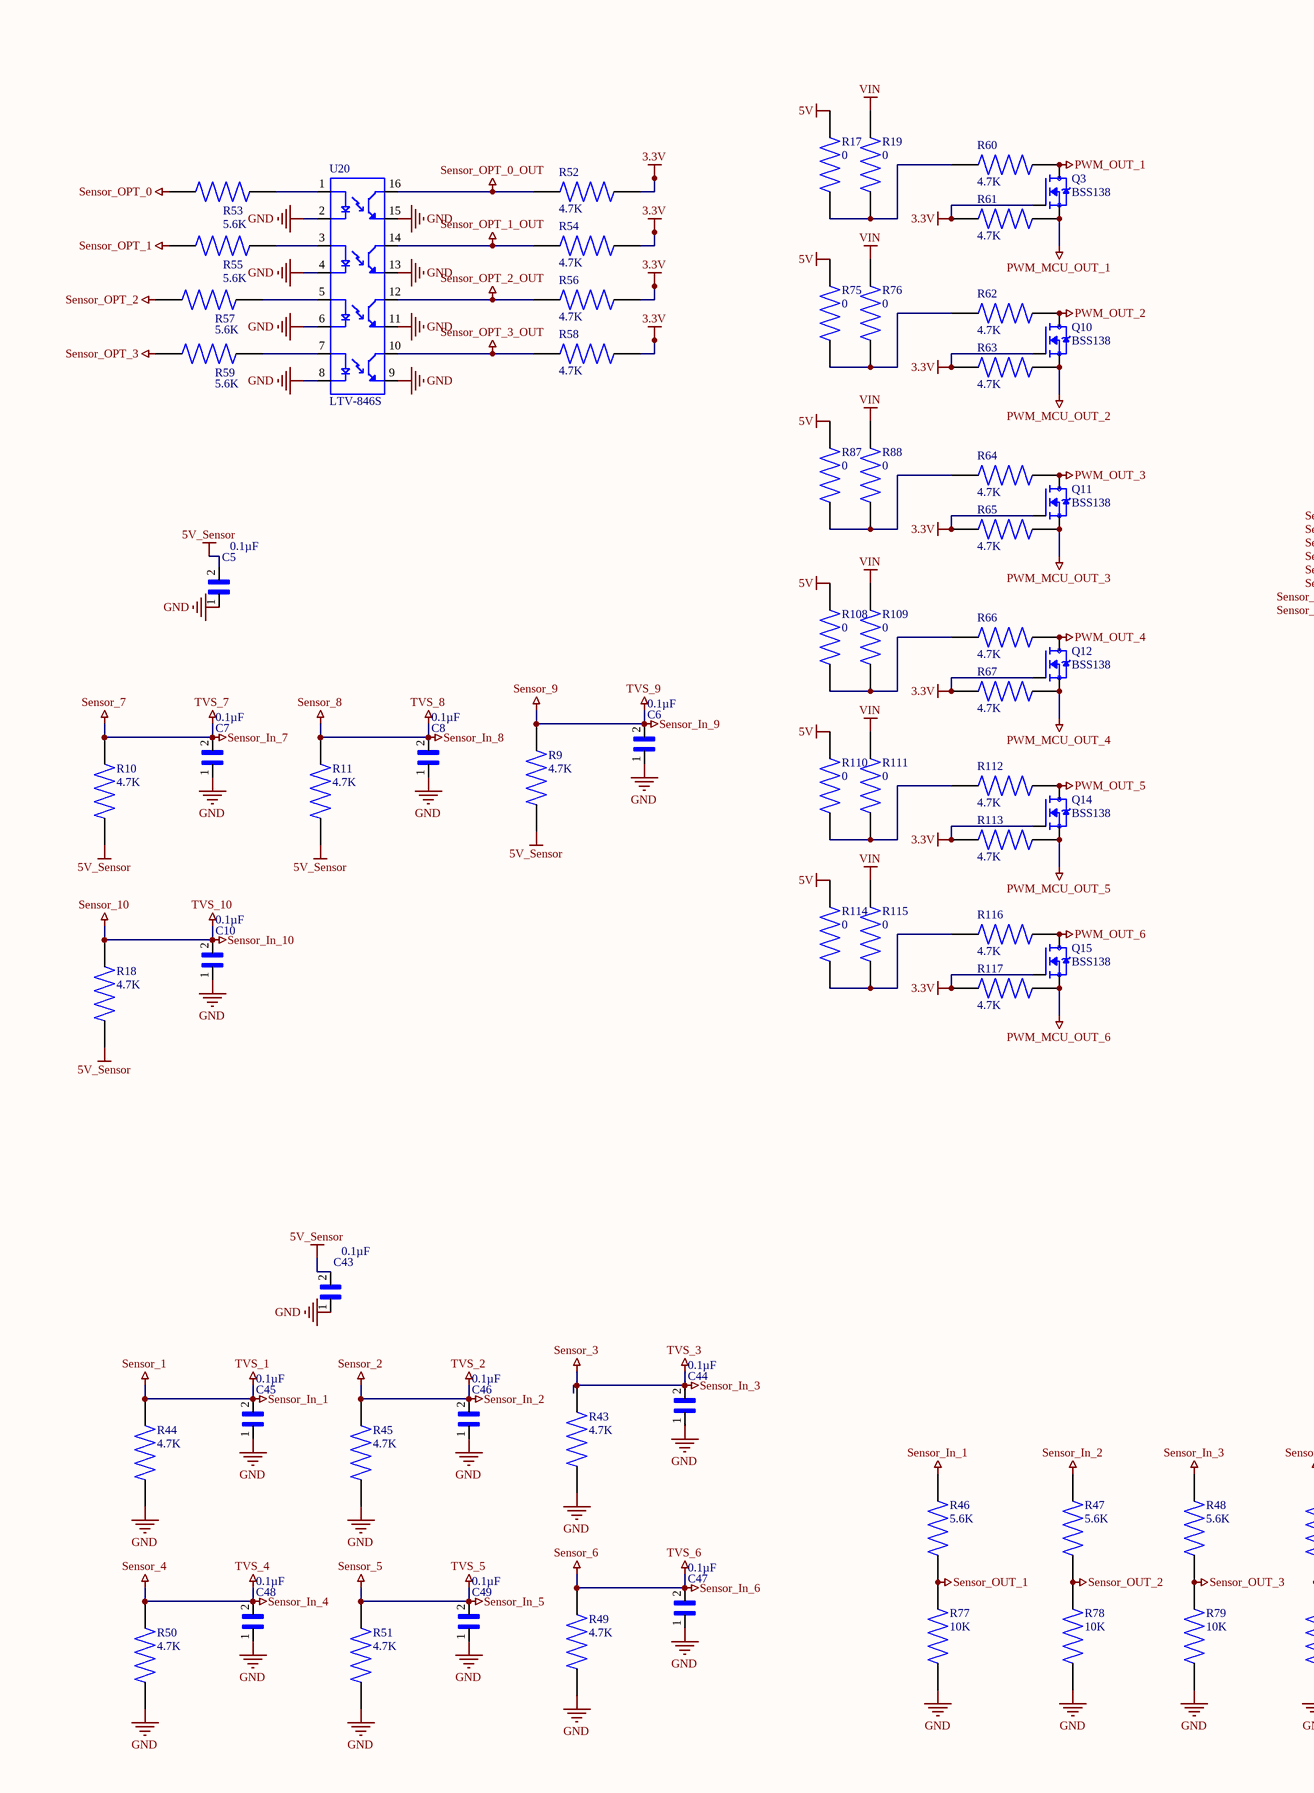
[diagram p2: Analog_Sensors_Sheet.SchDoc, left]
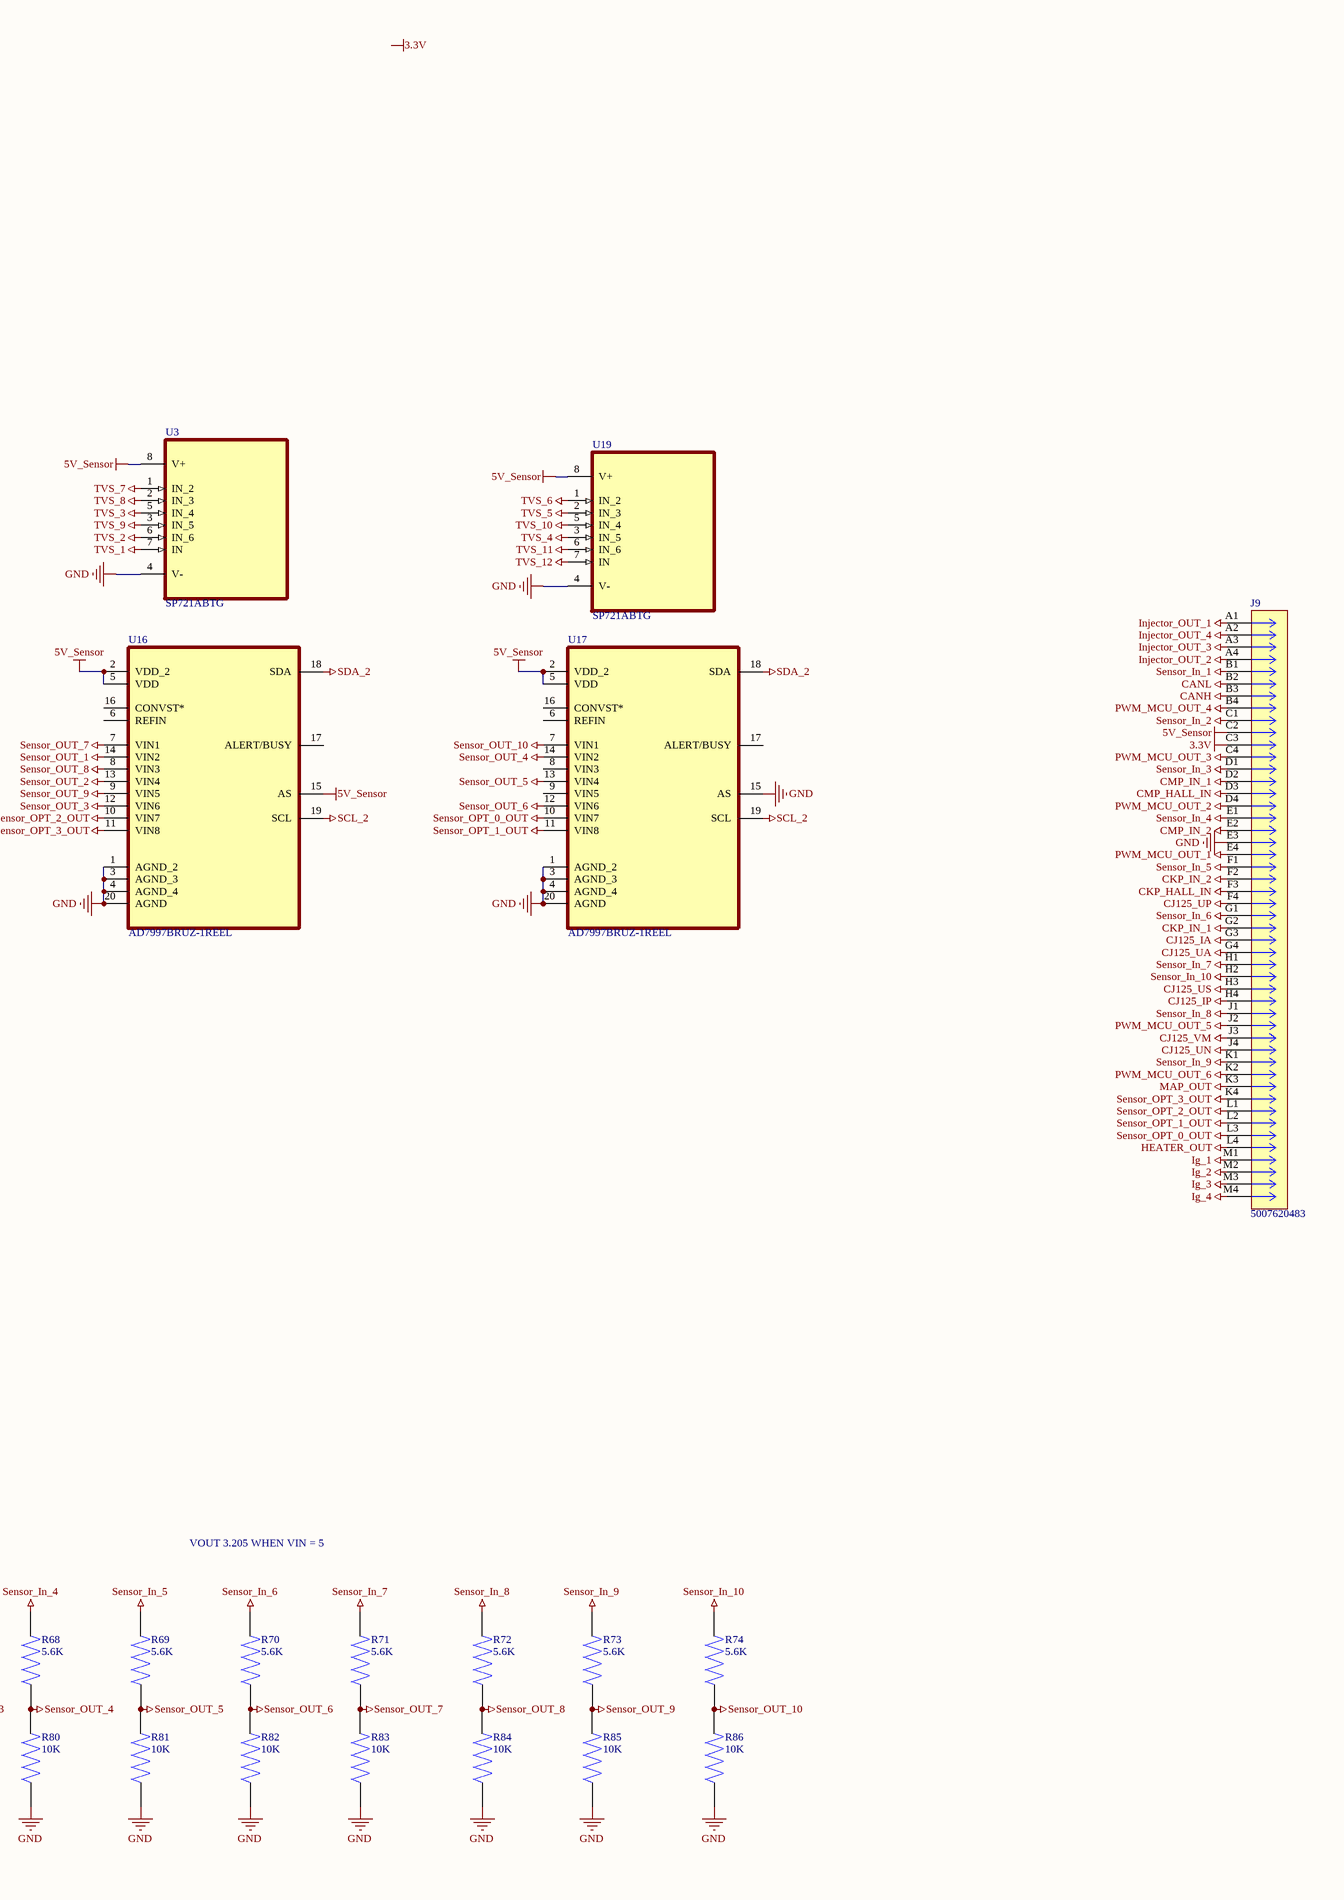
[diagram p3: Analog_Sensors_Sheet.SchDoc, right]

### Parts
C5  0.1µF  [CAPC1608X90N]
C6  0.1µF  [CAPC1608X90N]
C7  0.1µF  [CAPC1608X90N]
C8  0.1µF  [CAPC1608X90N]
C10  0.1µF  [CAPC1608X90N]
C43  0.1µF  [CAPC1608X90N]
C44  0.1µF  [CAPC1608X90N]
C45  0.1µF  [CAPC1608X90N]
C46  0.1µF  [CAPC1608X90N]
C47  0.1µF  [CAPC1608X90N]
C48  0.1µF  [CAPC1608X90N]
C49  0.1µF  [CAPC1608X90N]
J9  5007620483  [CONN_SD-500762-001_MOL]
Q3  BSS138  [SOT95P240X111-3N]
Q10  BSS138  [SOT95P240X111-3N]
Q11  BSS138  [SOT95P240X111-3N]
Q12  BSS138  [SOT95P240X111-3N]
Q14  BSS138  [SOT95P240X111-3N]
Q15  BSS138  [SOT95P240X111-3N]
R9  4.7K  [RESC3116X65N]
R10  4.7K  [RESC3116X65N]
R11  4.7K  [RESC3116X65N]
R17  0  [RESC3116X65N]
R18  4.7K  [RESC3116X65N]
R19  0  [RESC3116X65N]
R43  4.7K  [RESC3116X65N]
R44  4.7K  [RESC3116X65N]
R45  4.7K  [RESC3116X65N]
R46  5.6K  [RESC3116X65N]
R47  5.6K  [RESC3116X65N]
R48  5.6K  [RESC3116X65N]
R49  4.7K  [RESC3116X65N]
R50  4.7K  [RESC3116X65N]
R51  4.7K  [RESC3116X65N]
R52  4.7K  [RES_ERJS06J472V]
R53  5.6K  [RESC3216X70N]
R54  4.7K  [RES_ERJS06J472V]
R55  5.6K  [RESC3216X70N]
R56  4.7K  [RES_ERJS06J472V]
R57  5.6K  [RESC3216X70N]
R58  4.7K  [RES_ERJS06J472V]
R59  5.6K  [RESC3216X70N]
R60  4.7K  [RESC3116X65N]
R61  4.7K  [RESC3116X65N]
R62  4.7K  [RESC3116X65N]
R63  4.7K  [RESC3116X65N]
R64  4.7K  [RESC3116X65N]
R65  4.7K  [RESC3116X65N]
R66  4.7K  [RESC3116X65N]
R67  4.7K  [RESC3116X65N]
R68  5.6K  [RESC3116X65N]
R69  5.6K  [RESC3116X65N]
R70  5.6K  [RESC3116X65N]
R71  5.6K  [RESC3116X65N]
R72  5.6K  [RESC3116X65N]
R73  5.6K  [RESC3116X65N]
R74  5.6K  [RESC3116X65N]
R75  0  [RESC3116X65N]
R76  0  [RESC3116X65N]
R77  10K  [RESC3116X65N]
R78  10K  [RESC3116X65N]
R79  10K  [RESC3116X65N]
R80  10K  [RESC3116X65N]
R81  10K  [RESC3116X65N]
R82  10K  [RESC3116X65N]
R83  10K  [RESC3116X65N]
R84  10K  [RESC3116X65N]
R85  10K  [RESC3116X65N]
R86  10K  [RESC3116X65N]
R87  0  [RESC3116X65N]
R88  0  [RESC3116X65N]
R108  0  [RESC3116X65N]
R109  0  [RESC3116X65N]
R110  0  [RESC3116X65N]
R111  0  [RESC3116X65N]
R112  4.7K  [RESC3116X65N]
R113  4.7K  [RESC3116X65N]
R114  0  [RESC3116X65N]
R115  0  [RESC3116X65N]
R116  4.7K  [RESC3116X65N]
R117  4.7K  [RESC3116X65N]
U3  SP721ABTG  [SOIC127P600X175-8N]
U16  AD7997BRUZ-1REEL  [SOP65P640X120-20N]
U17  AD7997BRUZ-1REEL  [SOP65P640X120-20N]
U19  SP721ABTG  [SOIC127P600X175-8N]
U20  LTV-846S  [SOIC254P1016X460-16N]

### Nets
3.3V: J9.C3 Q3.1(G) Q10.1(G) Q11.1(G) Q12.1(G) Q14.1(G) Q15.1(G) R52.2 R54.2 R56.2 R58.2 R61.2 R63.2 R65.2 R67.2 R113.2 R117.2
5V: R17.2 R75.2 R87.2 R108.2 R110.2 R114.2
5V_Sensor: C5.2 C43.2 J9.C2 R9.1 R10.1 R11.1 R18.1 U3.8(V+) U16.2(VDD_2) U16.5(VDD) U16.15(AS) U17.2(VDD_2) U17.5(VDD) U19.8(V+)
CANH: J9.B3
CANL: J9.B2
CJ125_IA: J9.G3
CJ125_IP: J9.H4
CJ125_UA: J9.G4
CJ125_UN: J9.J4
CJ125_UP: J9.F4
CJ125_US: J9.H3
CJ125_VM: J9.J3
CKP_HALL_IN: J9.F3
CKP_IN_1: J9.G2
CKP_IN_2: J9.F2
CMP_HALL_IN: J9.D3
CMP_IN_1: J9.D2
CMP_IN_2: J9.E2
GND: C5.1 C6.1 C7.1 C8.1 C10.1 C43.1 C44.1 C45.1 C46.1 C47.1 C48.1 C49.1 J9.E3 R43.1 R44.1 R45.1 R49.1 R50.1 R51.1 R77.1 R78.1 R79.1 R80.1 R81.1 R82.1 R83.1 R84.1 R85.1 R86.1 U3.4(V-) U16.1(AGND_2) U16.3(AGND_3) U16.4(AGND_4) U16.20(AGND) U17.1(AGND_2) U17.3(AGND_3) U17.4(AGND_4) U17.15(AS) U17.20(AGND) U19.4(V-) U20.2(C1) U20.4(C2) U20.6(C3) U20.8(C4) U20.9(ET4) U20.11(ET3) U20.13(ET2) U20.15(ET1)  [project net Bat_Ground]
HEATER_OUT: J9.L4
Ig_1: J9.M1
Ig_2: J9.M2
Ig_3: J9.M3
Ig_4: J9.M4
Injector_OUT_1: J9.A1
Injector_OUT_2: J9.A4
Injector_OUT_3: J9.A3
Injector_OUT_4: J9.A2
MAP_OUT: J9.K3
PWM_MCU_OUT_1: J9.E4 Q3.2(S) R61.1
PWM_MCU_OUT_2: J9.D4 Q10.2(S) R63.1
PWM_MCU_OUT_3: J9.C4 Q11.2(S) R65.1
PWM_MCU_OUT_4: J9.B4 Q12.2(S) R67.1
PWM_MCU_OUT_5: J9.J2 Q14.2(S) R113.1
PWM_MCU_OUT_6: J9.K2 Q15.2(S) R117.1
PWM_OUT_1: Q3.3(D) R60.1
PWM_OUT_2: Q10.3(D) R62.1
PWM_OUT_3: Q11.3(D) R64.1
PWM_OUT_4: Q12.3(D) R66.1
PWM_OUT_5: Q14.3(D) R112.1
PWM_OUT_6: Q15.3(D) R116.1
SCL_2: U16.19(SCL) U17.19(SCL)
SDA_2: U16.18(SDA) U17.18(SDA)
Sensor_1: C45.2 J9.B1 R44.2 R46.2 U3.7(IN)  [also labelled Sensor_In_1, TVS_1]
Sensor_2: C46.2 J9.C1 R45.2 R47.2 U3.6(IN_6)  [also labelled Sensor_In_2, TVS_2]
Sensor_3: C44.2 J9.D1 R43.2 R48.2 U3.5(IN_4)  [also labelled Sensor_In_3, TVS_3]
Sensor_4: C48.2 J9.E1 R50.2 R68.2 U19.3(IN_5)  [also labelled Sensor_In_4, TVS_4]
Sensor_5: C49.2 J9.F1 R51.2 R69.2 U19.2(IN_3)  [also labelled Sensor_In_5, TVS_5]
Sensor_6: C47.2 J9.G1 R49.2 R70.2 U19.1(IN_2)  [also labelled Sensor_In_6, TVS_6]
Sensor_7: C7.2 J9.H1 R10.2 R71.2 U3.1(IN_2)  [also labelled Sensor_In_7, TVS_7]
Sensor_8: C8.2 J9.J1 R11.2 R72.2 U3.2(IN_3)  [also labelled Sensor_In_8, TVS_8]
Sensor_9: C6.2 J9.K1 R9.2 R73.2 U3.3(IN_5)  [also labelled Sensor_In_9, TVS_9]
Sensor_10: C10.2 J9.H2 R18.2 R74.2 U19.5(IN_4)  [also labelled Sensor_In_10, TVS_10]
Sensor_OPT_0: R53.1
Sensor_OPT_0_OUT: J9.L3 R52.1 U17.10(VIN7) U20.16(CT1)
Sensor_OPT_1: R55.1
Sensor_OPT_1_OUT: J9.L2 R54.1 U17.11(VIN8) U20.14(CT2)
Sensor_OPT_2: R57.1
Sensor_OPT_2_OUT: J9.L1 R56.1 U16.10(VIN7) U20.12(CT3)
Sensor_OPT_3: R59.1
Sensor_OPT_3_OUT: J9.K4 R58.1 U16.11(VIN8) U20.10(CT4)
Sensor_OUT_1: R46.1 R77.2 U16.14(VIN2)
Sensor_OUT_2: R47.1 R78.2 U16.13(VIN4)
Sensor_OUT_3: R48.1 R79.2 U16.12(VIN6)
Sensor_OUT_4: R68.1 R80.2 U17.14(VIN2)
Sensor_OUT_5: R69.1 R81.2 U17.13(VIN4)
Sensor_OUT_6: R70.1 R82.2 U17.12(VIN6)
Sensor_OUT_7: R71.1 R83.2 U16.7(VIN1)
Sensor_OUT_8: R72.1 R84.2 U16.8(VIN3)
Sensor_OUT_9: R73.1 R85.2 U16.9(VIN5)
Sensor_OUT_10: R74.1 R86.2 U17.7(VIN1)
TVS_11: U19.6(IN_6)
TVS_12: U19.7(IN)
VIN: R19.2 R76.2 R88.2 R109.2 R111.2 R115.2
NetR17_1: R17.1 R19.1 R60.2
NetR53_2: R53.2 U20.1(A1)
NetR55_2: R55.2 U20.3(A2)
NetR57_2: R57.2 U20.5(A3)
NetR59_2: R59.2 U20.7(A4)
NetR62_2: R62.2 R75.1 R76.1
NetR64_2: R64.2 R87.1 R88.1
NetR66_2: R66.2 R108.1 R109.1
NetR110_1: R110.1 R111.1 R112.2
NetR114_1: R114.1 R115.1 R116.2

Not connected (* = marked no-connect by the designer): U16 6(REFIN) 16(CONVST*) 17(ALERT/BUSY); U17 6(REFIN) 8(VIN3) 9(VIN5) 16(CONVST*) 17(ALERT/BUSY)

### Notes on the sheet
- VOUT 3.205 WHEN VIN = 5
- Labels drawn without touching a wire or pin: 3.3V

### Library data of the parts
C5-C8 C10 C43-C49 = 06035C104MAZ2A: as C1 on sheet ECU_Sheet; Package: None; Price: None; Value: *; MP: 06035C104MAZ2A; Availability: Unavailable
Q3 Q10-Q12 Q14 Q15 = BSS138: N-Channel 50 V 220mA (Ta) 350mW (Ta) Surface Mount SOT-23-3; MF: onsemi; SnapEDA_Link: https://www.snapeda.com/parts/BSS138/Onsemi/view-part/?ref=snap; Package: SOT-23-3 ON Semiconductor; Value: *; MP: BSS138; Check_prices: https://www.snapeda.com/parts/BSS138/Onsemi/view-part/?ref=eda
R9-R11 R17-R19 R43-R45 R49-R51 R60-R67 R75 R76 R87 R88 R108-R117 = RC1206FR-074K7L: 4.7 kOhms Â±1% 0.25W, 1/4W Chip Resistor 1206 (3216 Metric) Moisture Resistant Thick Film; MF: Yageo; SnapEDA_Link: https://www.snapeda.com/parts/RC1206FR-074K7L/Yageo/view-part/?ref=snap; Package: 3116 Yageo; Value: *; MP: RC1206FR-074K7L; Check_prices: https://www.snapeda.com/parts/RC1206FR-074K7L/Yageo/view-part/?ref=eda
R46-R48 R68-R74 R77-R86 = AA1206JR-07470RL: Package: None; Price: None; Value: *; MP: AA1206JR-07470RL; Availability: Unavailable
R52 R54 R56 R58 = ERJS06J472V: Price: None; Availability: Unavailable; MP: ERJS06J472V; Package: None; Value: *
R53 R55 R57 R59 = RK73H2BTTD2200F: Res Thick Film 1206 220 Ohm 1% 0.25W(1/4W) ?100ppm/?C SMD Automotive T/R; Package: None; Price: None; Value: *; MP: RK73H2BTTD2200F; Availability: Unavailable
U3 U19 = SP721ABTG: TVS Diode Arrays; Package: None; Price: None; Value: *; MP: SP721ABTG; Availability: Unavailable
U16 U17 = AD7997BRUZ-1REEL: Adc, 10-Bit, 188Ksps, Tssop-20; Resolution (Bits):10Bit; Sampling Rate:188Ksps; Input Channel Type:Single Ended; Data Interface:2 Wire, I2C; Supply Voltage Type:Single; Supply Voltage Min:2.7V; Supply Voltage Max:5.5V Rohs Compliant: Yes |Analog Devices A; MP: AD7997BRUZ1; SnapEDA_Link: https://www.snapeda.com/parts/AD7997BRUZ1/Analog+Devices/view-part/?ref=snap; Package: None; Value: *; MF: Analog Devices; Check_prices: https://www.snapeda.com/parts/AD7997BRUZ1/Analog+Devices/view-part/?ref=eda
U20 = LTV-846S: Optoisolator Transistor Output 5000Vrms 4 Channel 16-SMD; MF: Lite-On Inc.; Digi-Key_Purchase_URL: https://www.digikey.com/product-detail/en/lite-on-inc/LTV-846S/160-1365-5-ND/385835?utm_source=snapeda&utm_medium=aggregator&utm_campaign=symbol; Digi-Key_Part_Number: 160-1365-5-ND; Value: *; MP: LTV-846S; Package: SMD-16 Lite-On; SnapEDA_Link: https://www.snapeda.com/parts/LTV-846S/Lite-On%20Inc./view-part/233858/?ref=snap
J9 = 5007620483: Package: None; Price: None; Value: *; MP: 5007620483; Availability: Unavailable

## Sheet Display_IOT_Sheet.SchDoc
size A2; SheetNumber: 4; SheetTotal: 4

## Nets that join several sheets
3.3V: ECU_Sheet (43 pins), CCU_Sheet (16 pins), Analog_Sensors_Sheet (17 pins)
5V: ECU_Sheet (13 pins), CCU_Sheet (10 pins), Analog_Sensors_Sheet (6 pins)
5V_Sensor: ECU_Sheet (25 pins), Analog_Sensors_Sheet (14 pins)
Bat_Ground: ECU_Sheet (97 pins), CCU_Sheet (45 pins), Analog_Sensors_Sheet (48 pins)
CANH: ECU_Sheet (J11.7), Analog_Sensors_Sheet (J9.B3)
CANL: ECU_Sheet (J11.6), Analog_Sensors_Sheet (J9.B2)
CJ125_IA: ECU_Sheet (U12.4), Analog_Sensors_Sheet (J9.G3)
CJ125_IP: ECU_Sheet (U12.3), Analog_Sensors_Sheet (J9.H4)
CJ125_UA: ECU_Sheet (U12.21), Analog_Sensors_Sheet (J9.G4)
CJ125_UN: ECU_Sheet (C55.2 U12.2), Analog_Sensors_Sheet (J9.J4)
CJ125_UP: ECU_Sheet (U12.20), Analog_Sensors_Sheet (J9.F4)
CJ125_US: ECU_Sheet (U12.19), Analog_Sensors_Sheet (J9.H3)
CJ125_VM: ECU_Sheet (U12.18), Analog_Sensors_Sheet (J9.J3)
CKP_HALL_IN: ECU_Sheet (D23.C R92.2 R98.2), Analog_Sensors_Sheet (J9.F3)
CKP_IN_1: ECU_Sheet (C61.2 R41.1), Analog_Sensors_Sheet (J9.G2)
CKP_IN_2: ECU_Sheet (C61.1 R42.1), Analog_Sensors_Sheet (J9.F2)
CMP_HALL_IN: ECU_Sheet (D22.C R90.2 R91.2), Analog_Sensors_Sheet (J9.D3)
CMP_IN_1: ECU_Sheet (C59.2 R23.1), Analog_Sensors_Sheet (J9.D2)
CMP_IN_2: ECU_Sheet (C59.1 R25.1), Analog_Sensors_Sheet (J9.E2)
DATA_0: ECU_Sheet (U2.65), CCU_Sheet (J4.7)
DATA_1: ECU_Sheet (U2.66), CCU_Sheet (J4.8)
DATA_2: ECU_Sheet (U2.78), CCU_Sheet (J4.1)
DATA_3: ECU_Sheet (U2.79), CCU_Sheet (J4.2)
HEATER_OUT: ECU_Sheet (R27.1), Analog_Sensors_Sheet (J9.L4)
Ig_1: ECU_Sheet (Q5.2), Analog_Sensors_Sheet (J9.M1)
Ig_2: ECU_Sheet (Q6.2), Analog_Sensors_Sheet (J9.M2)
Ig_3: ECU_Sheet (Q7.2), Analog_Sensors_Sheet (J9.M3)
Ig_4: ECU_Sheet (Q8.2), Analog_Sensors_Sheet (J9.M4)
Injector_OUT_1: ECU_Sheet (D8.C D11.C Q4.C), Analog_Sensors_Sheet (J9.A1)
Injector_OUT_2: ECU_Sheet (D10.C D12.C Q9.C), Analog_Sensors_Sheet (J9.A4)
Injector_OUT_3: ECU_Sheet (D2.C D5.C Q1.C), Analog_Sensors_Sheet (J9.A3)
Injector_OUT_4: ECU_Sheet (D4.C D6.C Q2.C), Analog_Sensors_Sheet (J9.A2)
JTDI: ECU_Sheet (U2.77), CCU_Sheet (J5.06)
MAP_OUT: ECU_Sheet (C39.2 MAP1.4 R28.1 U2.16), Analog_Sensors_Sheet (J9.K3)
nRESET: ECU_Sheet (5 pins), CCU_Sheet (J5.10)
OSC_16_IN: ECU_Sheet (U2.12), CCU_Sheet (C24.2 Y2.1)
OSC_16_OUT: ECU_Sheet (U2.13), CCU_Sheet (C26.2 Y2.3)
OSC_32_IN: ECU_Sheet (U2.8), CCU_Sheet (C16.2 Y1.2)
OSC_32_OUT: ECU_Sheet (U2.9), CCU_Sheet (C21.2 Y1.1)
PWM_MCU_OUT_1: ECU_Sheet (U2.63), Analog_Sensors_Sheet (J9.E4 Q3.2 R61.1)
PWM_MCU_OUT_2: ECU_Sheet (U2.64), Analog_Sensors_Sheet (J9.D4 Q10.2 R63.1)
PWM_MCU_OUT_3: ECU_Sheet (U2.91), Analog_Sensors_Sheet (J9.C4 Q11.2 R65.1)
PWM_MCU_OUT_4: ECU_Sheet (U2.24), Analog_Sensors_Sheet (J9.B4 Q12.2 R67.1)
PWM_MCU_OUT_5: ECU_Sheet (U2.25), Analog_Sensors_Sheet (J9.J2 Q14.2 R113.1)
PWM_MCU_OUT_6: ECU_Sheet (U2.34), Analog_Sensors_Sheet (J9.K2 Q15.2 R117.1)
SCL_1: ECU_Sheet (U2.92), CCU_Sheet (J3.02 R22.2 U7.6)
SCL_2: ECU_Sheet (U2.46), CCU_Sheet (J7.02 R26.2), Analog_Sensors_Sheet (U16.19 U17.19)
SD_CK: ECU_Sheet (U2.80), CCU_Sheet (J4.5)
SD_CMD: ECU_Sheet (U2.83), CCU_Sheet (J4.3)
SDA_1: ECU_Sheet (U2.93), CCU_Sheet (J3.01 R21.1 U7.5)
SDA_2: ECU_Sheet (U2.47), CCU_Sheet (J7.01 R24.1), Analog_Sensors_Sheet (U16.18 U17.18)
SWCLK: ECU_Sheet (U2.76), CCU_Sheet (J5.04)
SWDIO: ECU_Sheet (U2.72), CCU_Sheet (J5.02)
SWO: ECU_Sheet (U2.89), CCU_Sheet (J5.07)
UART_1_RX: ECU_Sheet (U2.54), CCU_Sheet (D17.C J2.05 U21.2)
UART_1_TX: ECU_Sheet (U2.53), CCU_Sheet (D16.C J2.03 U21.3)
UART_2_RX: ECU_Sheet (U2.56), CCU_Sheet (D19.C J2.06)
UART_2_TX: ECU_Sheet (U2.55), CCU_Sheet (D18.C J2.04)
VIN: ECU_Sheet (C41.2 R33.1 U12.1), CCU_Sheet (6 pins), Analog_Sensors_Sheet (6 pins)